# Altium project Napelem_inverter.PrjPcb (part 1 of 2)
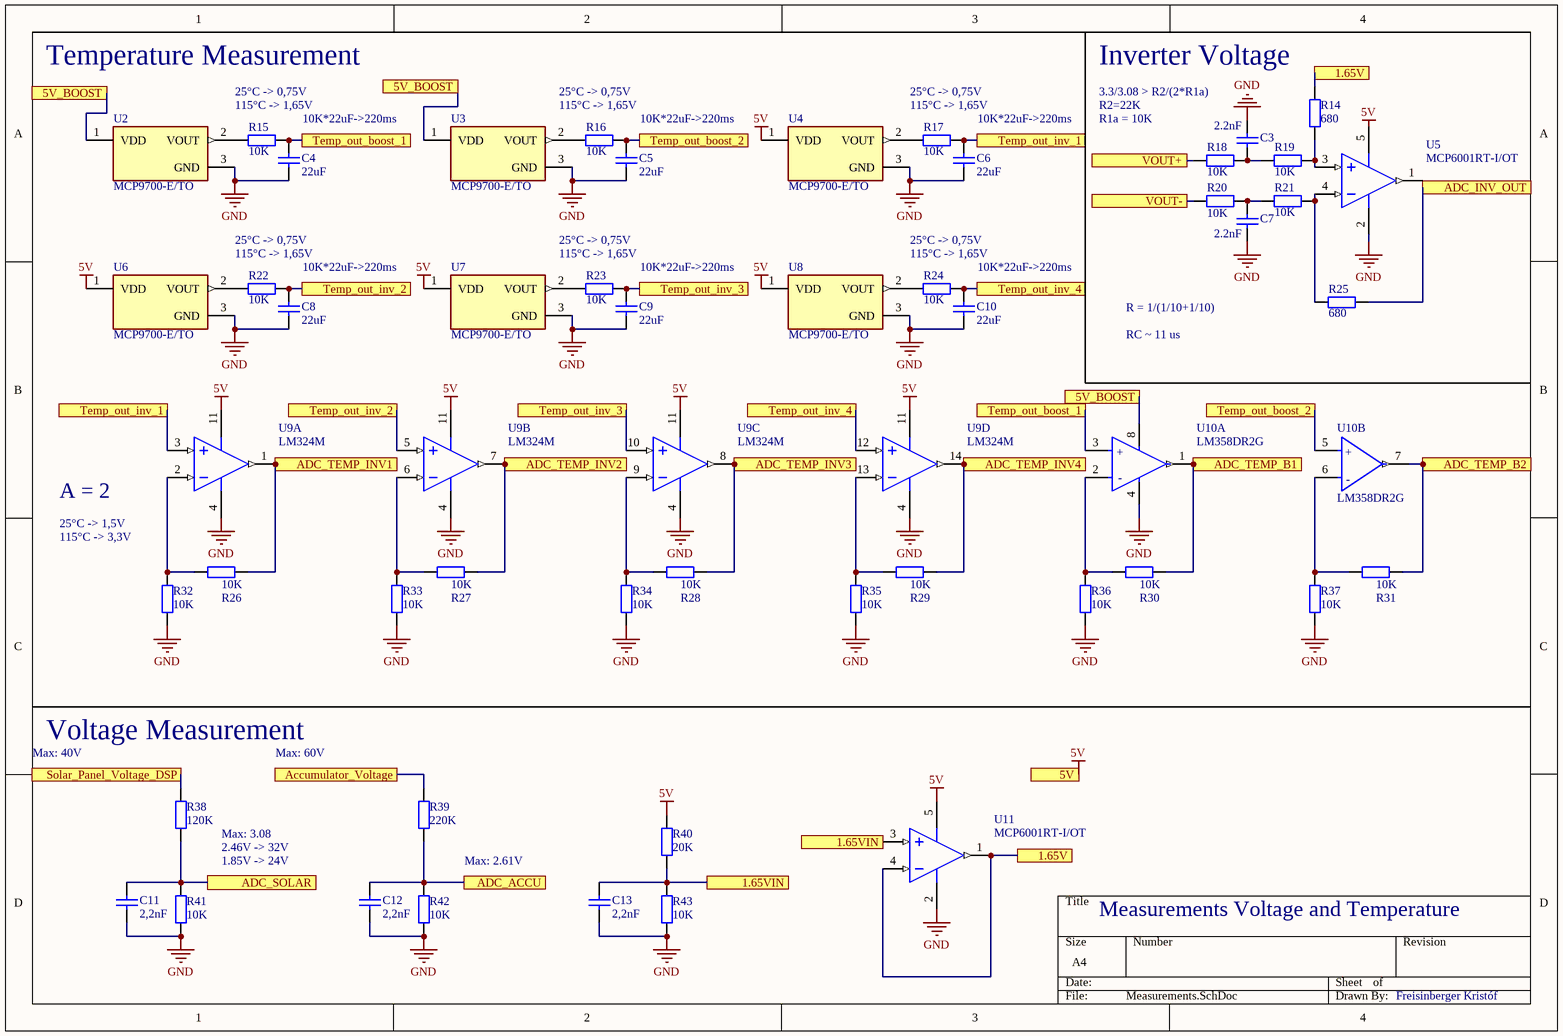
[diagram p0: Measurements.SchDoc]
12 sheets, 313 parts. Net scope: flat (ports and power ports of the same name join across sheets).
Board files: Boost.PcbDoc, Napelemes_inverter.PcbDoc, Boost_Test.PcbDoc, Napelem_inverter_0805.PcbDoc
Sheets:
  Measurements.SchDoc
  PowerSupply.SchDoc
  BoostConverter.SchDoc
  Inverter.SchDoc
  Gate-Driver.SchDoc
  Block_Design.SchDoc
    DSP = DSP.SchDoc
    Connectors = Connectors.SchDoc
    Current Measurement = Hall_sensor.SchDoc
    USB = USB_and_FTDI.SchDoc
  Display.SchDoc
  DSP_Supply.SchDoc

## Sheet Measurements.SchDoc
size A4

### Parts
C3  2.2nF  [FP_0805_CAP_085]
C4  22uF  [FP_0805_CAP_085]
C5  22uF  [FP_0805_CAP_085]
C6  22uF  [FP_0805_CAP_085]
C7  2.2nF  [FP_0805_CAP_085]
C8  22uF  [FP_0805_CAP_085]
C9  22uF  [FP_0805_CAP_085]
C10  22uF  [FP_0805_CAP_085]
C11  2,2nF  [FP_0805_CAP_085]
C12  2,2nF  [FP_0805_CAP_085]
C13  2,2nF  [FP_0805_CAP_085]
R14  680  [FP_0805_RES]
R15  10K  [FP_0805_RES]
R16  10K  [FP_0805_RES]
R17  10K  [FP_0805_RES]
R18  10K  [FP_0805_RES]
R19  10K  [FP_0805_RES]
R20  10K  [FP_0805_RES]
R21  10K  [FP_0805_RES]
R22  10K  [FP_0805_RES]
R23  10K  [FP_0805_RES]
R24  10K  [FP_0805_RES]
R25  680  [FP_0805_RES]
R26  10K  [FP_0805_RES]
R27  10K  [FP_0805_RES]
R28  10K  [FP_0805_RES]
R29  10K  [FP_0805_RES]
R30  10K  [FP_0805_RES]
R31  10K  [FP_0805_RES]
R32  10K  [FP_0805_RES]
R33  10K  [FP_0805_RES]
R34  10K  [FP_0805_RES]
R35  10K  [FP_0805_RES]
R36  10K  [FP_0805_RES]
R37  10K  [FP_0805_RES]
R38  120K  [FP_0805_RES]
R39  220K  [FP_0805_RES]
R40  20K  [FP_0805_RES]
R41  10K  [FP_0805_RES]
R42  10K  [FP_0805_RES]
R43  10K  [FP_0805_RES]
U2  MCP9700-E/TO  [FP-C04-101-MFG]
U3  MCP9700-E/TO  [FP-C04-101-MFG]
U4  MCP9700-E/TO  [FP-C04-101-MFG]
U5  MCP6001RT-I/OT  [SOT-23-OT5_M]
U6  MCP9700-E/TO  [FP-C04-101-MFG]
U7  MCP9700-E/TO  [FP-C04-101-MFG]
U8  MCP9700-E/TO  [FP-C04-101-MFG]
U9  LM324M  [FP_SOIC14]  (parts A,B,C,D of 4)
U10  LM358DR2G  [FP-751-07-IPC_C]  (parts A,B of 2)
U11  MCP6001RT-I/OT  [SOT-23-OT5_M]

### Ports
1.65V, 1.65VIN, 5V, 5V_BOOST, Accumulator_Voltage, ADC_ACCU, ADC_INV_OUT, ADC_SOLAR, ADC_TEMP_B1, ADC_TEMP_B2, ADC_TEMP_INV1, ADC_TEMP_INV2, ADC_TEMP_INV3, ADC_TEMP_INV4, Solar_Panel_Voltage_DSP, Temp_out_boost_1, Temp_out_boost_2, Temp_out_inv_1, Temp_out_inv_2, Temp_out_inv_3, Temp_out_inv_4, VOUT+, VOUT-

### Nets
5V: R40.2 U4.1(VDD) U6.1(VDD) U7.1(VDD) U8.1(VDD) U9.11(GND) U11.5(VSS) ; port 5V
GND: C3.2 C4.1 C5.1 C6.1 C7.1 C8.1 C9.1 C10.1 C11.1 C12.1 C13.1 R32.1 R33.1 R34.1 R35.1 R36.1 R37.1 R41.1 R42.1 R43.1 U2.3(GND) U3.3(GND) U4.3(GND) U5.2(VDD) U6.3(GND) U7.3(GND) U8.3(GND) U9.4(V+) U10.4(VEE/GND) U11.2(VDD)  [project net Accumulator_GND]
NetC3_1: C3.1 R18.2 R19.1
NetC4_2: C4.2 R15.2 U10.3(INPUT_A+) ; port Temp_out_boost_1
NetC5_2: C5.2 R16.2 U10.5(INPUT_B+) ; port Temp_out_boost_2
NetC6_2: C6.2 R17.2 U9.3(IN1+) ; port Temp_out_inv_1
NetC7_2: C7.2 R20.2 R21.1
NetC8_2: C8.2 R22.2 U9.5(IN2+) ; port Temp_out_inv_2
NetC9_2: C9.2 R23.2 U9.10(IN3+) ; port Temp_out_inv_3
NetC10_2: C10.2 R24.2 U9.12(IN4+) ; port Temp_out_inv_4
NetC11_2: C11.2 R38.1 R41.2 ; port ADC_SOLAR
NetC12_2: C12.2 R39.1 R42.2 ; port ADC_ACCU
NetC13_2: C13.2 R40.1 R43.2 U11.3(VIN+) ; port 1.65VIN
NetC14_1: R38.2 ; port Solar_Panel_Voltage_DSP
NetC31_2: R39.2 ; port Accumulator_Voltage
NetC44_1: R20.1 ; port VOUT-
NetC44_2: R18.1 ; port VOUT+
NetJ4_4: R30.1 U10.1(OUTPUT_A) ; port ADC_TEMP_B1
NetJ4_6: R31.1 U10.7(OUTPUT_B) ; port ADC_TEMP_B2
NetJ4_10: U2.1(VDD) U3.1(VDD) U10.8(VCC) ; port 5V_BOOST
NetP2_3: R25.2 ; port ADC_INV_OUT
NetP3_3: R26.1 U9.1(OUT1) ; port ADC_TEMP_INV1
NetP3_4: R27.1 U9.7(OUT2) ; port ADC_TEMP_INV2
NetP3_5: R28.1 U9.8(OUT3) ; port ADC_TEMP_INV3
NetP3_6: R29.1 U9.14(OUT4) ; port ADC_TEMP_INV4
NetR14_1: R14.1 R19.2 U5.3(VIN+)
NetR14_2: R14.2 U11.1(VOUT) U11.4(VIN-) ; port 1.65V
NetR15_1: R15.1 U2.2(VOUT)
NetR16_1: R16.1 U3.2(VOUT)
NetR17_1: R17.1 U4.2(VOUT)
NetR21_2: R21.2 R25.1 U5.4(VIN-)
NetR22_1: R22.1 U6.2(VOUT)
NetR23_1: R23.1 U7.2(VOUT)
NetR24_1: R24.1 U8.2(VOUT)
NetR26_2: R26.2 R32.2 U9.2(IN1-)
NetR27_2: R27.2 R33.2 U9.6(IN2-)
NetR28_2: R28.2 R34.2 U9.9(IN3-)
NetR29_2: R29.2 R35.2 U9.13(IN4-)
NetR30_2: R30.2 R36.2 U10.2(INPUT_A-)
NetR31_2: R31.2 R37.2 U10.6(INPUT_B-)

Not connected (* = marked no-connect by the designer): U5 1(VOUT) 5(VSS)

### Notes on the sheet
- Temperature Measurement
- 115°C -> 1,65V
- 25°C -> 0,75V
- 3.3/3.08 > R2/(2*R1a)
- (near R14) Inverter Voltage
- R2=22K
- 10K*22uF->220ms
- R1a = 10K
- R = 1/(1/10+1/10)
- RC ~ 11 us
- A = 2
- 115°C -> 3,3V
- 25°C -> 1,5V
- Max: 40V
- Voltage Measurement
- Max: 60V
- 2.46V -> 32V
- (near R38) Max: 3.08
- 1.85V -> 24V
- Max: 2.61V
- Measurements Voltage and Temperature
- Freisinberger Kristóf
- Labels drawn without touching a wire or pin: 5V
- (in symbol CMP-1310-00291-2, part A) +; -
- (in symbol CMP-1310-00291-2, part B) +; -

### Library data of the parts
C3-C13 = CAP: Capacitor
  C3 C7: Value: 2.2nF
  C4-C6 C8-C10: Value: 22uF
  C11-C13: Value: 2,2nF
R14-R43 = RES: Resistor
  R14 R25: Value: 680
  R15-R24 R26-R37 R41-R43: Value: 10K
  R38: Value: 120K
  R39: Value: 220K
  R40: Value: 20K
U2-U4 U6-U8 = CMP-0192-00001-2: SENSOR ANALOG -40C-125C TO92-3; Manufacturer: Microchip; Output Current: 100uA; Sensor Output: Analog Voltage; Output Voltage: 500mV; Max Supply Voltage: 5.5V; Import Ts: 1521170835; Min Supply Voltage: 2.3V; Operating Supply Current: 6uA; Max Junction Temp: +150°C; RoHS: TRUE; Height: 5.334mm; Manufacturer Part Number: MCP9700-E/TO; Ipc Land Pattern Name: TO-92; Digikey Description: SENSOR ANALOG -40C-125C TO92-3; Device Class L1: Sensors; Footprint Url: http://ww1.microchip.com/downloads/en/DeviceDoc/3L_TO-92%20Plastic%20Transistor%20Outline_TO_C04-00101c.pdf; Automotive: No; Mouser Description: Board Mount Temperature Sensors Lin Active Therm; ComponentLink2Description: Datasheet; Device Class L2: Temperature and Humidity Sensors; Ambient Temperature Range Low: -40°C; Package: C04-101; Device Class L3: unset; Temperature: -40°C to +125°C; Ambient Temperature Range High: +125°C; Temperature Range High: +125°C; Lead Free: Yes; Category: IC; ComponentLink2URL: http://ww1.microchip.com/downloads/en/DeviceDoc/20001942G.pdf; Temperature Range Low: -40°C; Octopart: https://octopart.com/mcp9700-e%2Fto-microchip-668812
U5 U11 = CMP-0187-00469-2: 1 MHz, Low-Power Operational Amplifier, 5-Pin SOT-23, Industrial Temperature, Tape and Reel; ComponentLink1URL: http://www.microchip.com/; DatasheetVersion: revJ, Nov-2009; PackageVersion: revBB, Aug-2009; RevisionNote: URLs added.; ComponentLink1Description: Manufacturer URL; PackageReference: SOT-23-OT5; ComponentLink3Description: Package Specification; ComponentLink2Description: Datasheet; ComponentLink2URL: http://ww1.microchip.com/downloads/en/DeviceDoc/21733j.pdf; ComponentLink3URL: http://www.microchip.com/stellent/groups/techpub_sg/documents/packagingspec/en012702.pdf; PackageDescription: 5-Lead Plastic Small Outline Transistor (OT) [SOT-23]; Code_IPC: SOT23-5
U9 = LM324M: Low Power Quad Operational Amplifier, 14-pin Narrow SOIC; Code_JEDEC: MS-012AB; Code_IPC: SOIC127P600-14; ComponentLink1Description: LM324 Datasheet; ComponentLink1URL: http://www.national.com/ds/LM/LM324.pdf; ComponentLink2Description: LM324 Web Page; ComponentLink2URL: http://www.national.com/pf/LM/LM324.html; ComponentLink3Description: M14A Package Page; ComponentLink3URL: http://www.national.com/packaging/folders/m14a.html
U10 = CMP-1310-00291-2: IC OPAMP GP 2 CIRCUIT 8SOIC; Gain Bandwidth Product: 1MHz; Number of Circuits: 2; Min Supply Voltage: 3V; Slew Rate: 0.6V/µs; Max Dual Supply Voltage: 16V; Common Mode Rejection Ratio: 65dB; Input Bias Current: 250nA; Min Dual Supply Voltage: 1.5V; Dual Supply Voltage: 9V; Operating Supply Current: 1.5mA; Output Current: 40mA; Input Offset Voltage (Vos): 7mV; Nominal Supply Current: 1.2mA; Voltage Gain: 100dB; Max Supply Voltage: 32V; Width: 4mm; Number of Pins: 8; Min Operating Temperature: 0°C; REACH SVHC: No SVHC; Contact Plating: Tin; Lead Free: Lead Free; Halogen Free: Halogen Free; Power Supply Rejection Ratio (PSRR): 65dB; Operating Supply Voltage: 16V; Package Quantity: 2500; Max Operating Temperature: 70°C; Case/Package: SOIC; Height: 1.5mm; Packaging: Tape and Reel; Radiation Hardening: No; Number of Channels: 2; Bandwidth: 1MHz; Length: 5mm; Number of Elements: 2; Number of Amplifiers: 2; Output Current per Channel: 40mA

## Sheet PowerSupply.SchDoc
size A4
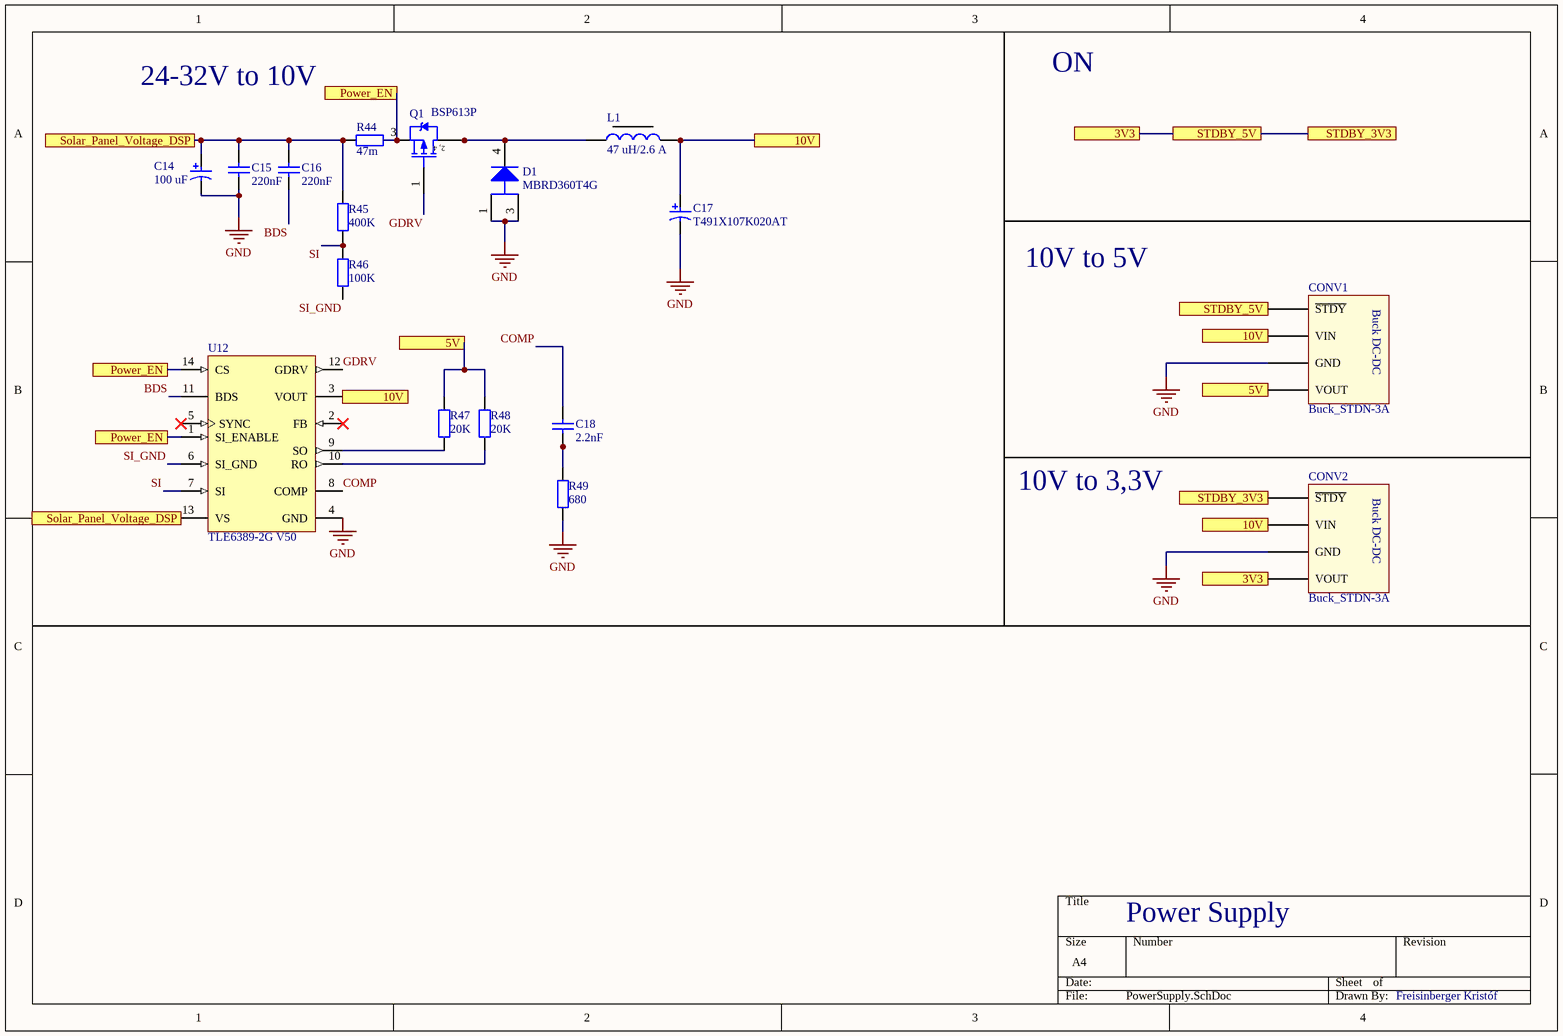
[diagram p1: PowerSupply.SchDoc]

### Parts
C14  100 uF  [NIC-UVR-10x12.5-2_V]
C15  220nF  [FP_0805_CAP_085]
C16  220nF  [FP_0805_CAP_085]
C17  T491X107K020AT  [KEMT-7343-43_L]
C18  2.2nF  [FP_0805_CAP_085]
CONV1  Buck_STDN-3A  [Buck_STDN-3A24-ADJ]
CONV2  Buck_STDN-3A  [Buck_STDN-3A24-ADJ]
D1  MBRD360T4G  [ONSC-DPAK-3-369C-01_V]
L1  47 uH/2.6 A  [Tekercs_B82479-A1473-M - duplicate]
Q1  BSP613P  [INF-PG-SOT223_SC-73_M]
R44  47m  [FP_0805_RES]
R45  400K  [FP_0805_RES]
R46  100K  [FP_0805_RES]
R47  20K  [FP_0805_RES]
R48  20K  [FP_0805_RES]
R49  680  [FP_0805_RES]
U12  TLE6389-2G V50  [INF-PG-DSO-14-1_M]

### Ports
3V3, 5V, 10V, Power_EN, Solar_Panel_Voltage_DSP, STDBY_3V3, STDBY_5V

### Nets
3V3: CONV1.1(~{STDY}) CONV2.1(~{STDY}) CONV2.4(VOUT) ; port STDBY_5V, port STDBY_3V3, port 3V3
5V: CONV1.4(VOUT) R47.2 R48.2 ; port 5V
10V: C17.1 CONV1.2(VIN) CONV2.2(VIN) L1.2(Out) U12.3(VOUT) ; port 10V
GND: C14.2 C15.1 C17.2 CONV1.3(GND) CONV2.3(GND) D1.1(A) D1.3(A) R49.1 U12.4(GND)  [project net Accumulator_GND]
BDS: C16.1 U12.11(BDS)
COMP: C18.2 U12.8(COMP)
GDRV: Q1.1(GATE) U12.12(GDRV)
SI: R45.1 R46.2 U12.7(SI)
SI_GND: R46.1 U12.6(SI_GND)
NetC14_1: C14.1 C15.2 C16.2 R44.2 R45.2 U12.13(VS) ; port Solar_Panel_Voltage_DSP
NetC18_1: C18.1 R49.2
NetD1_4: D1.4(K) L1.1(In) Q1.2(DRAIN) Q1.4(DRAIN)
NetQ1_3: Q1.3(SOURCE) R44.1 U12.1(SI_ENABLE) U12.14(CS) ; port Power_EN
NetR47_1: R47.1 U12.9(SO)
NetR48_1: R48.1 U12.10(RO)

Not connected (* = marked no-connect by the designer): U12 2(FB)* 5(SYNC)*

### Notes on the sheet
- 24-32V to 10V
- ON
- 10V to 5V
- 10V to 3,3V
- Power Supply
- Freisinberger Kristóf
- (in symbol Buck_STDN-3A) Buck DC-DC
- (in symbol CMP-1099-00021-1) 2, 4

### Library data of the parts
C14 = CMP-1217-00001-1: Aluminum Electrolytic Capacitor, 63 V, -40 to 85 degC, 2-Pin CAP, RoHS; Manufacturer: Nichicon; PartNumber: UVR1J101MPD1TD; Capacitance Tolerance: +/-20%; Rated Voltage: 63 V; Packing: Bulk; Rated Ripple@85 degC 120 Hz: 300 mA; ComponentLink3URL: https://il.farnell.com/teapo/ksy107m063s1g5h1ck/cap-100-f-63v-20/dp/2901348?st=100%20uf%20electrolyte%20capacitor; ComponentLink2Description: Datasheet; Operating Temperature: -40 to 85 degC; PackageDescription: 2-Pin Through Hole Package, Dia 10 mm, Body Length 12.5 mm, Pitch 5 mm; Mounting Technology: Through Hole; ComponentLink3Description: Package Specification; RoHS: TRUE; DatasheetVersion: Sep-13; ComponentLink1Description: Manufacturer URL; ComponentLink2URL: https://il.farnell.com/teapo/ksy107m063s1g5h1ck/cap-100-f-63v-20/dp/2901348?st=100%20uf%20electrolyte%20capacitor; Rated Capacitance: 100 uF; ComponentLink1URL: http://www.nichicon.co.jp/
C15 C16 C18 = CAP: Capacitor
  C15 C16: Value: 220nF
  C18: Value: 2.2nF
C17 = CMP-2000-07204-1: Tantalum Surface Mount Capacitor, 100 uF, 25 V, -55 to 125 degC, 2-Pin Molded, RoHS, Tape and Reel; Manufacturer: Kemet; Manufacturer Size Code: X; ESR (Equivalent Series Resistance): 300mOhm; Tolerance: ±10%; Capacitance: 100µF; Voltage - Rated: 25V; Product Training Modules: CapacitorBasics-TypicalUsesforCapacitors; Other Names: 399-8410-6; Lifetime @ Temp.: 2000Hrs@85°C; Online Catalog: T491Series; EDA / CAD Models: DownloadfromAcceleratedDesigns; Mounting Type: SurfaceMount; Series: T491; Packaging: Digi-Reel®; Category: Capacitors; Family: TantalumCapacitors; Manufacturer URL: http://www.kemet.com/; Datasheet URL: https://ciiva.com/datasheet-click-3798150?src=ciiva&sig=eb1f20b4; Mounting Technology: SurfaceMount; Lead Spacing: -; Datasheet Version: 12/2015; Standard Package: 1; Type: Molded; Features: GeneralPurpose; Package Description: 2-Pin Molded Capacitor, Body 7.3 x 4.3 mm; Size / Dimension: 0.287"Lx0.169"W(7.30mmx4.30mm); Package Reference: Molded; Height - Seated (Max): 0.169"(4.30mm); Package / Case: 2917(7343Metric); Operating Temperature: -55°C~125°C
D1 = CMP-1055-00192-1: SWITCHMODE(TM) Power Rectifier, 3-Pin DPAK, Pb-Free, Tape and Reel; Manufacturer: On Semiconductor; Configuration: Single; IFSM Max (A): 75; Mounting Technology: Surface Mount; ComponentLink2Description: Datasheet; ComponentLink3URL: http://www.onsemi.cn/pub_link/Collateral/369C.PDF; DatasheetVersion: Rev. 8; ComponentLink2URL: http://www.onsemi.com/pub_link/Collateral/MBRD320-D.PDF; PackageDescription: 3-Pin Flange Mount, Body 6.54 x 6.095 mm, Pitch 2.29 mm; ComponentLink1URL: http://www.onsemi.com/; Packing: Tape and Reel; RoHS: TRUE; ComponentLink1Description: Manufacturer URL; ComponentLink3Description: Package Specification; PackageVersion: Rev. E, 02/2014; PackageReference: DPAK-3-369C-01; PartNumber: MBRD360T4G
L1 = Inductor_B82479A1473M000: Inductor Power Wirewound 47uH 20% 100KHz Ferrite 2.6A 87mOhm DCR Automotive T/R; Manufacturer: TDK EPCOS; Saturation Current: 4.5A; Shielding: Unshielded; DC Resistance (DCR): 87mR; Inductor Type: POWER INDUCTOR; Supplier 1: Farnell; Manufacturer Part Number: B82479A1473M000; RoHS: Yes; Category: Fixed Inductors; Stock 1: 25; Mount: Surface Mount; Case/Package: SMD/SMT; Number of Pins: 2; Core Material: Ferrite; Weight: 0.105822oz; Min Operating Temperature: -55°C; Max Operating Temperature: 150°C; Package Quantity: 250; Current Rating: 2.6A; Tolerance: 20%; Packaging: Tape and Reel; Inductance Tolerance: 20%; Self Resonant Frequency: 100kHz; Inductance: 47uH; Test Frequency: 100kHz; Max DC Current: 2.6A; Termination: SMD/SMT; RMS Current (Irms): 2.6A; DC Current: 2.6A; Series: B82479A1; Length: 18.54mm; Width: 0.6inch; Height: 7.11mm; Depth: 15.24mm; REACH SVHC: No SVHC; Military Standard: Not; Lead Free: Lead Free; RoHS Compliant: Yes; ComponentLink1URL: https://datasheet.ciiva.com/6692/b82479a1-6692885.pdf?src-supplier=Digi-Key; ComponentLink1Description: https://datasheet.ciiva.com/6692/b82479a1-6692885.pdf?src-supplier=Digi-Key; ComponentLink2URL: https://datasheet.ciiva.com/22683/1899175-22683671.pdf?src-supplier=Element14; ComponentLink2Description: https://datasheet.ciiva.com/22683/1899175-22683671.pdf?src-supplier=Element14; ComponentLink3URL: https://datasheet.ciiva.com/22683/1899175-22683672.pdf?src-supplier=Element14; ComponentLink3Description: https://datasheet.ciiva.com/22683/1899175-22683672.pdf?src-supplier=Element14; ComponentLink4URL: https://datasheet.ciiva.com/28652/b82479a1-28652056.pdf?src-supplier=Element14; ComponentLink4Description: https://datasheet.ciiva.com/28652/b82479a1-28652056.pdf?src-supplier=Element14
Q1 = CMP-1099-00021-1: P-Channel SIPMOS Small-Signal-Transistor, -60 V VDS, -2.9 A ID, -55 to 150 degC, PG-SOT223 (SC-73), Reel, Green; Manufacturer: Infineon; VDS (max): -60Â V; ID (max): -2.9Â A; QG: -22Â nC; VGS(th) (max): -4Â V; Rth: 100Â K/W; Polarity: P; VGS(th) (min): -2.1Â V; IDpuls (max): -11.6Â A; Mode: Enhancement; RDS (on) (max): 130Â mOhm; Pto t (max): 1.8Â W; Green: TRUE; ComponentLink2Description: Datasheet; DatasheetVersion: Rev. 2.7; ComponentLink3URL: http://www.infineon.com/dgdl/SOT223-Package_Overview.pdf?folderId=db3a30431936bc4b0119530470b03c3d&fileId=db3a30431936bc4b0119531d40b93c5c; Packing: Reel; Halogen-free: TRUE; PackageReference: PG-SOT223 (SC-73); PackageVersion: Apr-08; PackageDescription: 4-Pin Small Outline Transistor Package, 6.5 x 3.5 mm Body, 2.3 mm Pitch; ComponentLink2URL: http://www.infineon.com/dgdl/BSP613P_Rev2.7.pdf?folderId=db3a304314dca38901154a72e3951a65&fileId=db3a30433b47825b013b60ac86a96dc0; ComponentLink1Description: Manufacturer URL; ComponentLink3Description: Package Specification; Mounting Technology: Surface Mount; Technology: SIPMOS; PartNumber: BSP613P; ComponentLink1URL: http://www.infineon.com/
R44-R49 = RES: Resistor
  R44: Value: 47m
  R45: Value: 400K
  R46: Value: 100K
  R47 R48: Value: 20K
  R49: Value: 680
U12 = CMP-1093-00004-1: Step-Down DC/DC Controller, -40 to 150 degC, PG-DSO-14-1, Reel, Green; Manufacturer: Infineon; Output: Buck Converter; Iq (typ): 130 uA; VQ (max): 5V; Tolerance: 3%; Green: TRUE; IQ (max): 2,300 mA; ComponentLink1URL: http://www.infineon.com/; ComponentLink3URL: http://www.infineon.com/dgdl/DCDC-Controller-IFX80471-Data-Sheet-V10-Infineon.pdf?folderId=db3a304314dca3890115039cf70d0bf0&fileId=db3a30432e398416012e487ec6e42599; PartNumber: TLE6389-2G V50; PackageVersion: Apr-11; ComponentLink3Description: Package Specification; DatasheetVersion: Rev. 2.1; PackageReference: PG-DSO-14-1; PackageDescription: 14-Pin Plastic (Green) Dual Small Outline Package, 8.65 x 3.9 mm Body, 1.27 mm Pitch; ComponentLink2URL: http://www.infineon.com/dgdl/TLE6389-2-3_DS_21.pdf?folderId=db3a304412b407950112b408e8c90004&fileId=db3a304412b407950112b43641bf65a6&location=en.Products.Power_Management_ICs.DC_DC.DC_DC-Converter__Automotive_.DATASHEET.TLE6389-2-3_DS_21.pdf; Halogen-free: TRUE; ComponentLink1Description: Manufacturer URL; Packing: Reel; Mounting Technology: Surface Mount; ComponentLink2Description: Datasheet

## Sheet BoostConverter.SchDoc
size A4
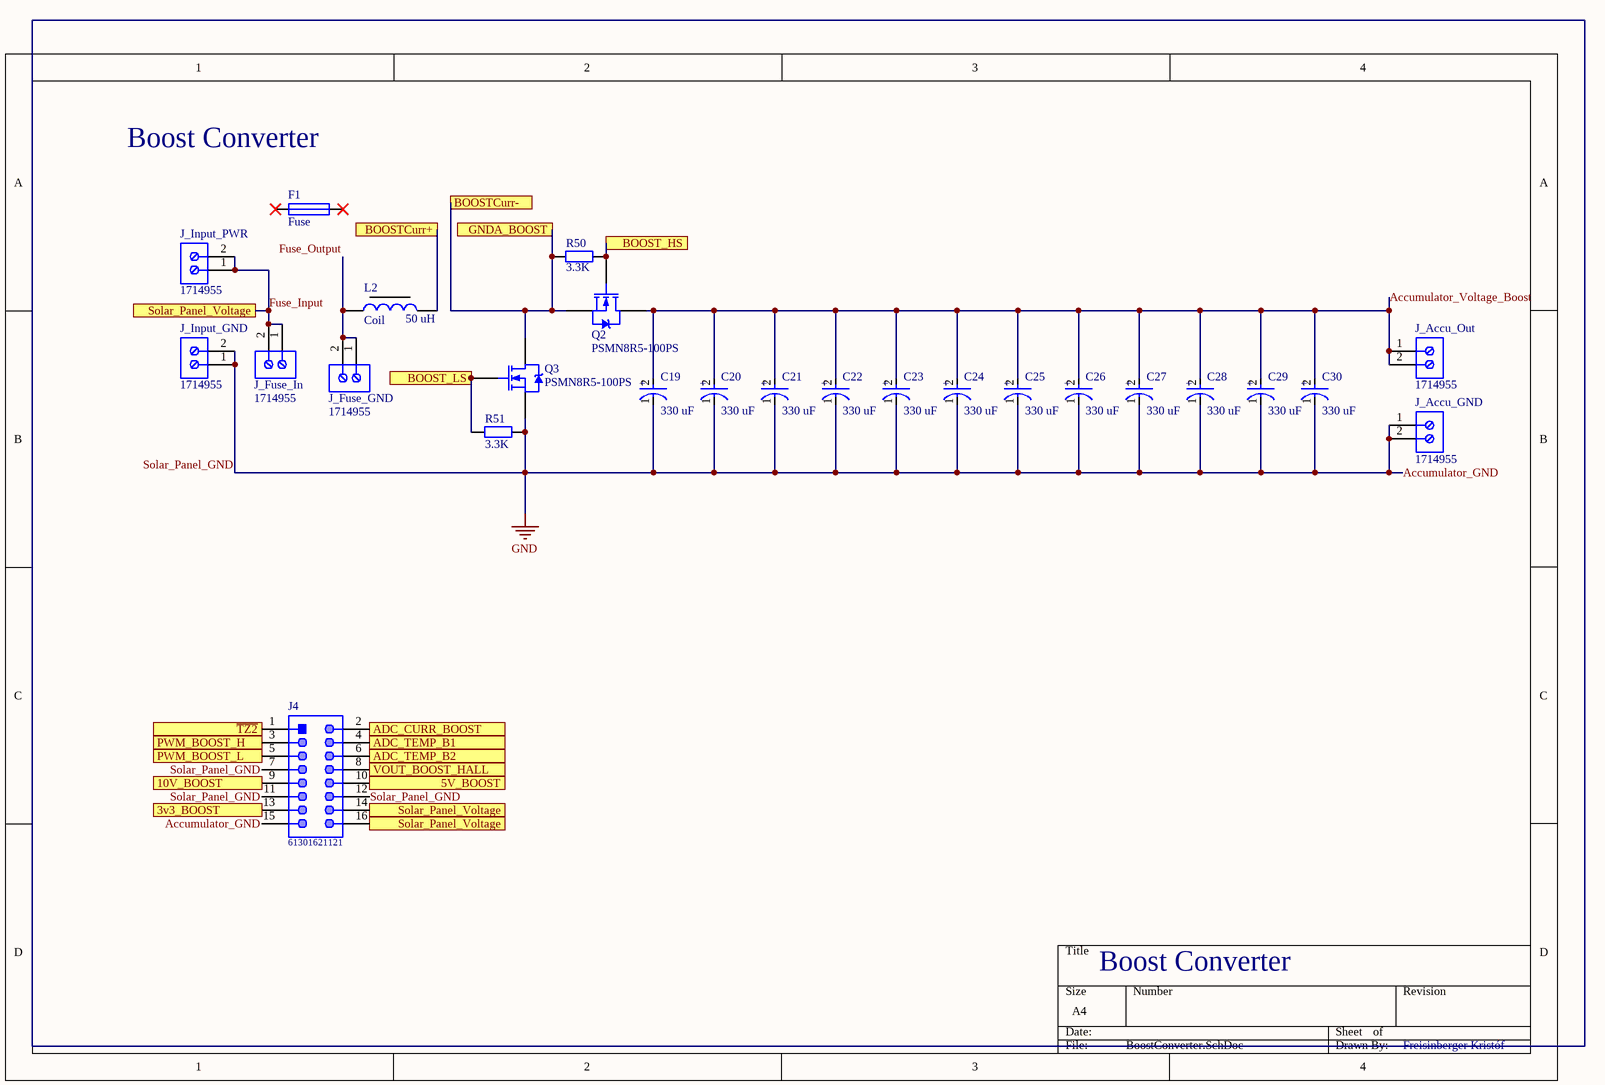
[diagram p2: BoostConverter.SchDoc]

### Parts
C19  330 uF  [FP-LXW18X25-MFG]
C20  330 uF  [FP-LXW18X25-MFG]
C21  330 uF  [FP-LXW18X25-MFG]
C22  330 uF  [FP-LXW18X25-MFG]
C23  330 uF  [FP-LXW18X25-MFG]
C24  330 uF  [FP-LXW18X25-MFG]
C25  330 uF  [FP-LXW18X25-MFG]
C26  330 uF  [FP-LXW18X25-MFG]
C27  330 uF  [FP-LXW18X25-MFG]
C28  330 uF  [FP-LXW18X25-MFG]
C29  330 uF  [FP-LXW18X25-MFG]
C30  330 uF  [FP-LXW18X25-MFG]
F1  Fuse
J4  61301621121  [61301621121]
J_Accu_GND  1714955  [Terminal-PHOE-1714955_V]
J_Accu_Out  1714955  [Terminal-PHOE-1714955_V]
J_Fuse_GND  1714955  [Terminal-PHOE-1714955_V]
J_Fuse_In  1714955  [Terminal-PHOE-1714955_V]
J_Input_GND  1714955  [Terminal-PHOE-1714955_V]
J_Input_PWR  1714955  [Terminal-PHOE-1714955_V]
L2  Coil  value 50 uH  [Tekercs_E65_FERRITE]
Q2  PSMN8R5-100PS  [FP-TO-220AB-MFG]
Q3  PSMN8R5-100PS  [FP-TO-220AB-MFG]
R50  3.3K  [FP_0805_RES]
R51  3.3K  [FP_0805_RES]

### Ports
3v3_BOOST, 5V_BOOST, 10V_BOOST, ADC_CURR_BOOST, ADC_TEMP_B1, ADC_TEMP_B2, BOOST_HS, BOOST_LS, BOOSTCurr+, BOOSTCurr-, GNDA_BOOST, PWM_BOOST_H, PWM_BOOST_L, Solar_Panel_Voltage, VOUT_BOOST_HALL, ~{TZ2}

### Nets
Accumulator_GND: C19.1(C) C20.1(C) C21.1(C) C22.1(C) C23.1(C) C24.1(C) C25.1(C) C26.1(C) C27.1(C) C28.1(C) C29.1(C) C30.1(C) J4.7 J4.11 J4.12 J4.15 J_Accu_GND.1 J_Accu_GND.2 J_Input_GND.1 J_Input_GND.2 Q3.3(S) R51.2  [also labelled GND, Solar_Panel_GND]
Accumulator_Voltage_Boost: C19.2(A) C20.2(A) C21.2(A) C22.2(A) C23.2(A) C24.2(A) C25.2(A) C26.2(A) C27.2(A) C28.2(A) C29.2(A) C30.2(A) J_Accu_Out.1 J_Accu_Out.2 Q2.2(D)
Fuse_Input: J4.14 J4.16 J_Fuse_In.1 J_Fuse_In.2 J_Input_PWR.1 J_Input_PWR.2 ; port Solar_Panel_Voltage
Fuse_Output: J_Fuse_GND.1 J_Fuse_GND.2 L2.1(In)
NetC58_2: J4.9 ; port 10V_BOOST
NetC60_1: Q2.3(S) Q3.2(D) R50.1 ; port BOOSTCurr-, port GNDA_BOOST
NetC69_1: J4.2 ; port ADC_CURR_BOOST
NetC102_2: J4.13 ; port 3v3_BOOST
NetJ4_1: J4.1 ; port ~{TZ2}
NetJ4_3: J4.3 ; port PWM_BOOST_H
NetJ4_4: J4.4 ; port ADC_TEMP_B1
NetJ4_5: J4.5 ; port PWM_BOOST_L
NetJ4_6: J4.6 ; port ADC_TEMP_B2
NetJ4_8: J4.8 ; port VOUT_BOOST_HALL
NetJ4_10: J4.10 ; port 5V_BOOST
NetL2_2: L2.2(Out) ; port BOOSTCurr+
NetQ2_1: Q2.1(G) R50.2 ; port BOOST_HS
NetQ3_1: Q3.1(G) R51.1 ; port BOOST_LS

Not connected (* = marked no-connect by the designer): F1 1* 2*

### Notes on the sheet
- Boost Converter
- Freisinberger Kristóf
- (in symbol CMP-35376-000008-1) +

### Library data of the parts
C19-C30 = CMP-35376-000008-1: CAP ALUM 47UF 20% 500V THRUHOLE / 500LXW47MEFR18X25
F1 = Fuse_Fork_Lift_157.5700.5501: LITTELFUSE   157.5700.5501   Automotive Fuse, Fork Lift Truck, 157.5700 Series, 50 A, Fast Acting, 48 V; Body Material: ZINC ALLOY; Current Rating: 50A; Voltage Rating (DC): 48V; Type: Electrical; Voltage Rating: 80V; Supplier 1: Digi-Key; Manufacturer: Littelfuse; Manufacturer Part Number: 157.5700.5501; RoHS: Yes; Category: Fuses; Stock 1: 20; Pricing 1: 1=1,98000, 5=1,89000, 10=1,79600, 50=1,44900, 100=1,22850, 250=1,19700, 500=1,00800, 1000=0,89775, 5000=0,83790 (USD); Mount: Bolt; Min Operating Temperature: -40°C; Max Operating Temperature: 125°C; Fuse Current: 50A; Packaging: Bulk; Series: -; Termination: Lug; Length: 82mm; Width: 20mm; Height: 0.03inch; REACH SVHC: Unknown; RoHS Compliant: Yes; ComponentLink1URL: https://datasheet.ciiva.com/1729/68907-1729142.pdf?src-supplier=Newark; ComponentLink1Description: https://datasheet.ciiva.com/1729/68907-1729142.pdf?src-supplier=Newark; ComponentLink2URL: https://datasheet.ciiva.com/1547/68907-1547992.pdf?src-supplier=Element14; ComponentLink2Description: https://datasheet.ciiva.com/1547/68907-1547992.pdf?src-supplier=Element14
J4 = CMP-1502-01097-1: THT Vertical Pin Header WR-PHD, Pitch 2.54 mm, Dual Row, 16 pins; Manufacturer: Wurth Elektronik; Gender: Male; Rated Current: 3A; Pitch: 2.54mm; Withstanding Voltage: 500VAC; Contact Resistance: 20mOhm; Working Voltage: 250VAC; Pin Number: 16; Mounting Technology: THT; Orientation: Vertical; Manufacturer URL: http://www.we-online.de; Row Number: Dual; Part Number: 61301621121; Datasheet URL: https://katalog.we-online.de/em/datasheet/6130xx21121.pdf; Packaging: Bag; Operating Temperature: -40to105degC; Publisher: WurthElektronik; Package Reference: 61301621121
J_Accu_GND J_Accu_Out J_Fuse_GND J_Fuse_In J_Input_GND J_Input_PWR = Terminal-CMP-2000-05797-1: PC Terminal Block, Pitch 6.35 mm, 1 x 2 Position, Height 21.5 mm, Tail Lenght 5.1 mm, RoHS, Bulk; Manufacturer: Phoenix Contact; Package Description: PC Terminal Block, Pitch 6.35 mm, 1 x 2 Position, Height 21.5 mm, Tail Lenght 5.1 mm; Datasheet URL: http://media.digikey.com/pdf/Data%20Sheets/Phoenix%20Contact%20PDFs/1714955.pdf; Package Reference: 1714955; Manufacturer URL: http://www.phoenixcontact.com/; Datasheet Version: 02/2010; Mounting Technology: ThroughHole
L2 = Coil: 50 uH; Category: Inductor
Q2 Q3 = NMOS-2: N-channel 100 V 8.5 mΩ standard level MOSFET in TO220; Note: Pin 2 is electrically connected to pin 4.; Published: 8-Jun-2000; LatestRevisionDate: 17-Jul-2002; LatestRevisionNote: Re-released for DXP Platform.; DatasheetVersion: PD-9.814; PackageVersion: Feb-1997; PackageReference: TO-220AB; Publisher: Altium Limited; PackageDescription: TO, Thru-Hole, Vertical, Heatsink Mounted; 3 In-Line Leads; Pitch 2.54 mm; ComponentLink1Description: Manufacturer Link; ComponentLink1URL: http://www.irf.com/
R50 R51 = RES: Resistor; Value: 3.3K

## Sheet Inverter.SchDoc
size A4
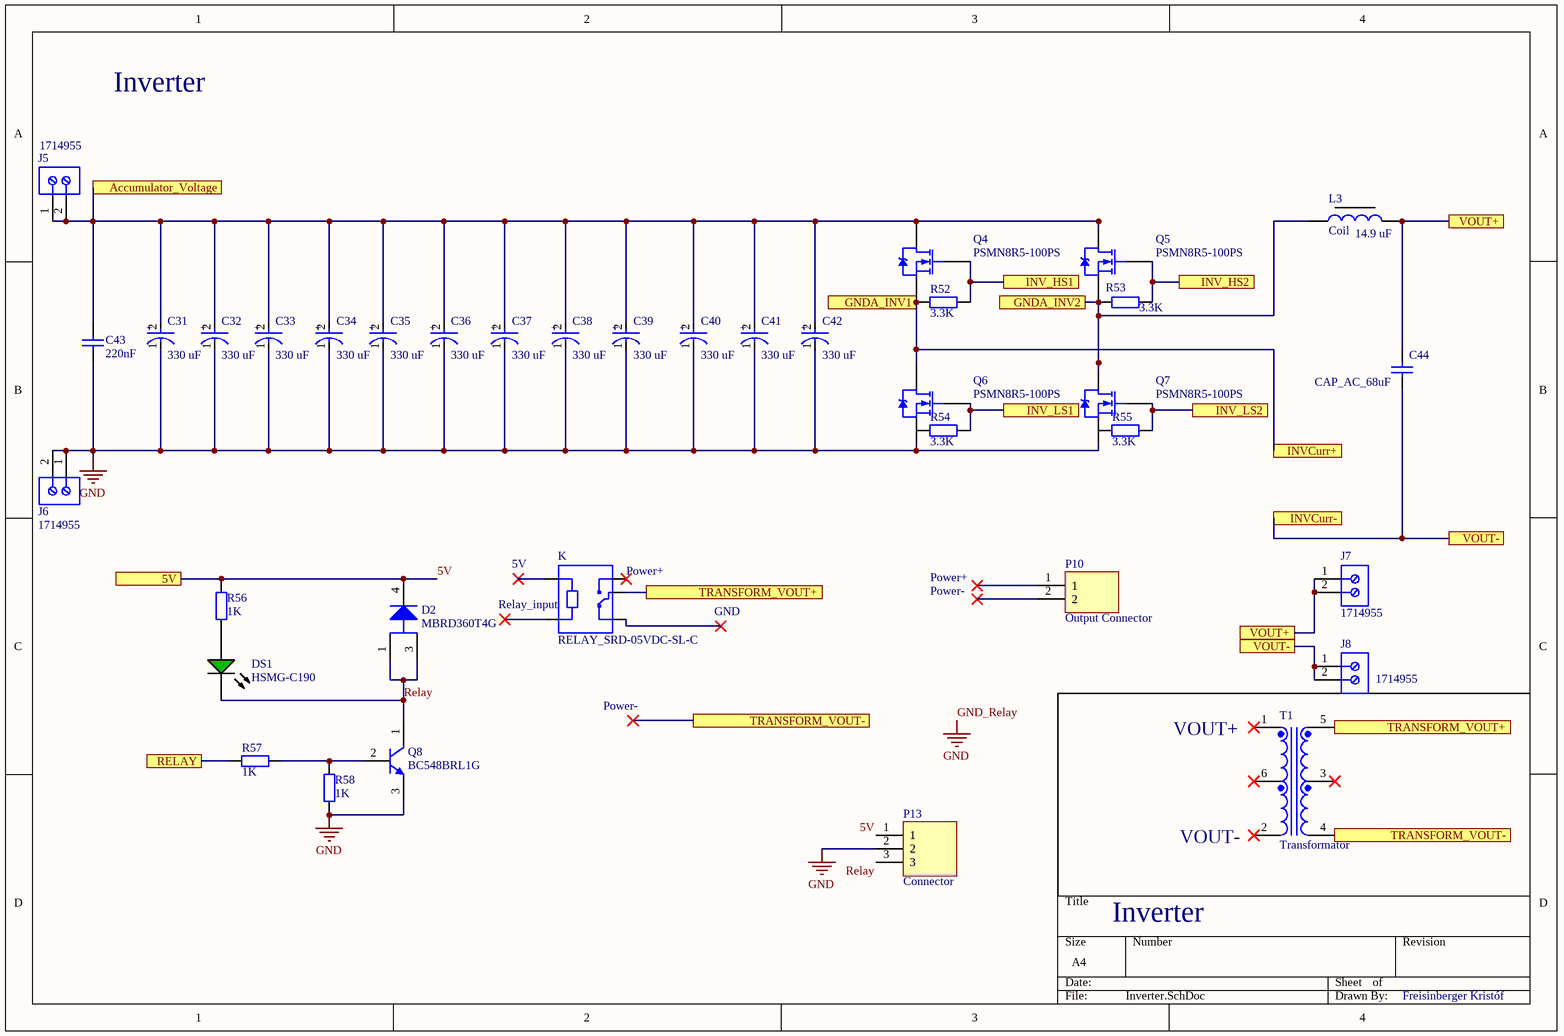
[diagram p3: Inverter.SchDoc]

### Parts
C31  330 uF  [FP-LXW18X25-MFG]
C32  330 uF  [FP-LXW18X25-MFG]
C33  330 uF  [FP-LXW18X25-MFG]
C34  330 uF  [FP-LXW18X25-MFG]
C35  330 uF  [FP-LXW18X25-MFG]
C36  330 uF  [FP-LXW18X25-MFG]
C37  330 uF  [FP-LXW18X25-MFG]
C38  330 uF  [FP-LXW18X25-MFG]
C39  330 uF  [FP-LXW18X25-MFG]
C40  330 uF  [FP-LXW18X25-MFG]
C41  330 uF  [FP-LXW18X25-MFG]
C42  330 uF  [FP-LXW18X25-MFG]
C43  220nF  [FP_0805_CAP_085]
C44  CAP_AC_68uF  [Capacitor_AC_68_uF]
D2  MBRD360T4G  [ONSC-DPAK-3-369C-01_V]
DS1  HSMG-C190  [AVAG-HSMX-C190_V]
J5  1714955  [Terminal-PHOE-1714955_V]
J6  1714955  [Terminal-PHOE-1714955_V]
J7  1714955  [Terminal-PHOE-1714955_V]
J8  1714955  [Terminal-PHOE-1714955_V]
K  RELAY_SRD-05VDC-SL-C  [FP_CONN3_2MM_90]
L3  Coil  value 14.9 uF  [Tekercs_E65_FERRITE]
P10  Output Connector  [FP_CONN2_TAP_254MM]
P13  Connector  [FP_CONN3_TAP_254MM]
Q4  PSMN8R5-100PS  [FP-TO-220AB-MFG]
Q5  PSMN8R5-100PS  [FP-TO-220AB-MFG]
Q6  PSMN8R5-100PS  [FP-TO-220AB-MFG]
Q7  PSMN8R5-100PS  [FP-TO-220AB-MFG]
Q8  BC548BRL1G  [ONSC-TO-92-3-29-11_AM_BL]
R52  3.3K  [FP_0603_RES]
R53  3.3K  [FP_0603_RES]
R54  3.3K  [FP_0603_RES]
R55  3.3K  [FP_0603_RES]
R56  1K  [FP_0603_RES]
R57  1K  [FP_0603_RES]
R58  1K  [FP_0603_RES]
T1  Transformator  [TDK-ALT3232_V]

### Ports
5V, Accumulator_Voltage, GNDA_INV1, GNDA_INV2, INV_HS1, INV_HS2, INV_LS1, INV_LS2, INVCurr+, INVCurr-, RELAY, TRANSFORM_VOUT+, TRANSFORM_VOUT-, VOUT+, VOUT-

### Nets
5V: D2.4(K) P13.1 R56.2 ; port 5V
GND: C31.1(C) C32.1(C) C33.1(C) C34.1(C) C35.1(C) C36.1(C) C37.1(C) C38.1(C) C39.1(C) C40.1(C) C41.1(C) C42.1(C) C43.1 J6.1 J6.2 P13.2 Q6.3(S) Q7.3(S) Q8.3(E) R58.1  [also labelled GND_Relay]  [project net Accumulator_GND]
Relay: D2.1(A) D2.3(A) DS1.2(K) P13.3 Q8.1(C)
NetC31_2: C31.2(A) C32.2(A) C33.2(A) C34.2(A) C35.2(A) C36.2(A) C37.2(A) C38.2(A) C39.2(A) C40.2(A) C41.2(A) C42.2(A) C43.2 J5.1 J5.2 Q4.2(D) Q5.2(D) ; port Accumulator_Voltage
NetC44_1: C44.1 J8.1 J8.2 ; port VOUT-, port INVCurr-
NetC44_2: C44.2 J7.1 J7.2 L3.2(Out) ; port VOUT+
NetC52_1: Q4.3(S) Q6.2(D) R52.1 ; port INVCurr+, port GNDA_INV1
NetC56_1: L3.1(In) Q5.3(S) Q7.2(D) R53.1 ; port GNDA_INV2
NetDS1_1: DS1.1(A) R56.1
NetK_COM: K.COM T1.5 ; port TRANSFORM_VOUT+
NetQ4_1: Q4.1(G) R52.2 ; port INV_HS1
NetQ5_1: Q5.1(G) R53.2 ; port INV_HS2
NetQ6_1: Q6.1(G) R54.2 ; port INV_LS1
NetQ7_1: Q7.1(G) R55.2 ; port INV_LS2
NetQ8_2: Q8.2(B) R57.2 R58.2
NetR57_1: R57.1 ; port RELAY
NetT1_4: T1.4 ; port TRANSFORM_VOUT-

Not connected (* = marked no-connect by the designer): K A1* A2* NC* NO*; P10 1* 2*; R54 1; R55 1; T1 1* 2* 3* 6*

### Notes on the sheet
- Inverter
- (near K) 5V
- (near K) Power+
- Power+
- (near K) Relay_input
- GND
- Power-
- VOUT+
- (near T1) VOUT-
- Freisinberger Kristóf
- (in symbol CMP-35376-000008-1) +

### Library data of the parts
C31-C42 = CMP-35376-000008-1: as C19 on sheet BoostConverter
C43 = CAP: Capacitor; Value: 220nF
C44 = CAP_AC_68uF: Cap Film 68uF 100V PET 10% (31.5 X 22 X 36.5mm) Radial 27.5mm 125C Bulk; Manufacturer: TDK EPCOS; Manufacturer Part Number: B32524Q1686K000; Dielectric Material: Polyester; Lead Diameter: 0.8mm; Supplier 1: Digi-Key; RoHS: Yes; Category: Film Capacitors; Stock 1: 15; Pricing 1: 1=16,57000, 10=15,74200, 50=13,25680, 100=12,42830, 500=11,01972, 1000=10,35688 (USD); Case/Package: Radial; Min Operating Temperature: -55°C; Max Operating Temperature: 125°C; Capacitance: 68uF; Tolerance: 10%; Packaging: Bulk; Dielectric: PET; Voltage Rating (DC): 100V; Voltage Rating: 100V; Length: 31.5mm; Lead Pitch: 27.5mm; Depth: 22mm; REACH SVHC: No SVHC; RoHS Compliant: Yes; ComponentLink1URL: http://www.farnell.com/datasheets/1955213.pdf?src-supplier=Farnell; ComponentLink1Description: http://www.farnell.com/datasheets/1955213.pdf?src-supplier=Farnell; ComponentLink2URL: http://components.arrow.com/part/dataview/0323_01924821?src-supplier=Arrow+Europe; ComponentLink2Description: http://components.arrow.com/part/dataview/0323_01924821?src-supplier=Arrow+Europe; ComponentLink3URL: https://www.tdk-electronics.tdk.com/inf/20/20/db/fc_2009/B32520_529.pdf?src-supplier=Digi-Key; ComponentLink3Description: https://www.tdk-electronics.tdk.com/inf/20/20/db/fc_2009/B32520_529.pdf?src-supplier=Digi-Key; ComponentLink4URL: http://www.farnell.com/datasheets/1955213.pdf?src-supplier=Element14; ComponentLink4Description: http://www.farnell.com/datasheets/1955213.pdf?src-supplier=Element14
D2 = CMP-1055-00192-1: as D1 on sheet PowerSupply; Mounting Technology: Surface Mount; ComponentLink2Description: Datasheet; ComponentLink3URL: http://www.onsemi.cn/pub_link/Collateral/369C.PDF; DatasheetVersion: Rev. 8; ComponentLink2URL: http://www.onsemi.com/pub_link/Collateral/MBRD320-D.PDF; PackageDescription: 3-Pin Flange Mount, Body 6.54 x 6.095 mm, Pitch 2.29 mm; ComponentLink1URL: http://www.onsemi.com/; Packing: Tape and Reel; RoHS: TRUE; ComponentLink1Description: Manufacturer URL; ComponentLink3Description: Package Specification; PackageVersion: Rev. E, 02/2014; PackageReference: DPAK-3-369C-01; PartNumber: MBRD360T4G
DS1 = LED_G_CMP-1744-00002-1_1: Chip LED, Green, 2.2 V, -40 to 85 degC, 2-Pin SMD, RoHS, Tape and Reel; Frequency: 400 KHz; Max Supply Voltage: 5.5 V; Access Time: 3500 ns; Clock Frequency: 100 KHz; Case\Package: SOIC; Density: 32 kb; Nominal Supply Current: 2 mA; Interface: Serial; Min Supply Voltage: 1.7 V; Packaging: Tape and Reel; PackageReference: HSMX-C190; ComponentLink2URL: http://docs.avagotech.com/docs/AV02-0551EN; RoHSCompliant: true; Pins: 8; REACH SVHC: No SVHC; Max Operating Temperature: 85 degC; Width: 4 mm; Radiation Hardening: No; Package Quantity: 3000; ComponentLink3Description: Package Specification; ComponentLink1Description: Manufacturer URL; Min Operating Temperature: -40 degC; PackageDescription: 2-Pin Surface Mount Device, Body 1.6 x 0.8 mm, Height 0.9 mm; Max Clock Frequency: 100 KHz; Height: 1.5 mm; ComponentLink1URL: http://www.avagotech.com/; DatasheetVersion: Mar-12; ComponentLink2Description: Datasheet; Mount: Surface Mount; Length: 5 mm; ComponentLink3URL: http://www.fairchildsemi.com/dwg/MA/MA03D.pdf
J5-J8 = Terminal-CMP-2000-05797-1: as J_Accu_GND on sheet BoostConverter; Package Description: PC Terminal Block, Pitch 6.35 mm, 1 x 2 Position, Height 21.5 mm, Tail Lenght 5.1 mm; Datasheet URL: http://media.digikey.com/pdf/Data%20Sheets/Phoenix%20Contact%20PDFs/1714955.pdf; Package Reference: 1714955; Manufacturer URL: http://www.phoenixcontact.com/; Datasheet Version: 02/2010; Mounting Technology: ThroughHole
K = RELAY_SRD-05VDC-SL-C: 5V Trigger Relay Module For Arduino And Raspberry Pi 5V Trigger Relay Module For Arduino And Raspberry Pi; MF: Songle Relay; Package: None; Availability: Unavailable; Value: *; MP: SRD-05VDC-SL-C; SnapEDA_Link: https://www.snapeda.com/parts/SRD-05VDC-SL-C/Songle%20Relay/view-part/1029484/?ref=snap; Price: None
L3 = Tekercs: 14.9 uH inductor; Category: Inductor
P10 = Connector_2pin: 2pin connector
P13 = Connector_3pin: 3pin connector
Q4-Q7 = NMOS-2: as Q2 on sheet BoostConverter; Published: 8-Jun-2000; LatestRevisionDate: 17-Jul-2002; LatestRevisionNote: Re-released for DXP Platform.; DatasheetVersion: PD-9.814; PackageVersion: Feb-1997; PackageReference: TO-220AB; Publisher: Altium Limited; PackageDescription: TO, Thru-Hole, Vertical, Heatsink Mounted; 3 In-Line Leads; Pitch 2.54 mm; ComponentLink1Description: Manufacturer Link; ComponentLink1URL: http://www.irf.com/
Q8 = CMP-1048-01603-1: Amplifier Transistor, NPN Silicon, 3-Pin TO-92, Pb-Free, Tape and Reel; Manufacturer: On Semiconductor; fT Min (MHz): 150; IC Continuous (A): 0.1; ComponentLink3Description: Package Specification; ComponentLink1Description: Manufacturer URL; Packing: Tape and Reel; ComponentLink1URL: http://www.onsemi.com/; PackageReference: TO-92-3-29-11_AM_BL; Polarity: NPN; ComponentLink3URL: http://www.onsemi.com/pub_link/Collateral/MAC97-D.PDF; DatasheetVersion: Rev. 7; PackageDescription: 3-Pin Transistor Outline, Body 4.825 x 3.685 mm, Pitch 1.27 mm; ComponentLink2Description: Datasheet; PartNumber: BC548BRL1G; Mounting Technology: Through Hole; PackageVersion: Rev. AM; RoHS: TRUE; ComponentLink2URL: http://www.onsemi.com/pub_link/Collateral/BC546-D.PDF
R52-R58 = RES: Resistor
  R52-R55: Value: 3.3K
  R56-R58: Value: 1K
T1 = CMP-2000-05771-1: Pulse Transformer for LAN Interface, 2.5 dB, -40 to 85 degC, 6-Pin SMD, RoHS, Tape and Reel; Manufacturer: TDK; Insertion Loss: 2.5dB; Number of Output Ports: 1; Maximum Temperature: +85°C; Minimum Temperature: -40°C; Package Description: 6-Pin Surface Mount Device, Body 3.2 x 3.2 mm; Mounting Technology: SurfaceMount; Datasheet Version: 05/2016; Package Reference: ALT3232; Width: 3.2mm; Manufacturer URL: http://www.tdk.com/; Datasheet URL: https://product.tdk.com/info/en/catalog/datasheets/trans_alt_en.pdf; Length: 3.2mm; Mounting Type: SurfaceMount; Depth: 2.9mm; Dimensions: 3.2x3.2x2.9mm

## Sheet Gate-Driver.SchDoc
size A4
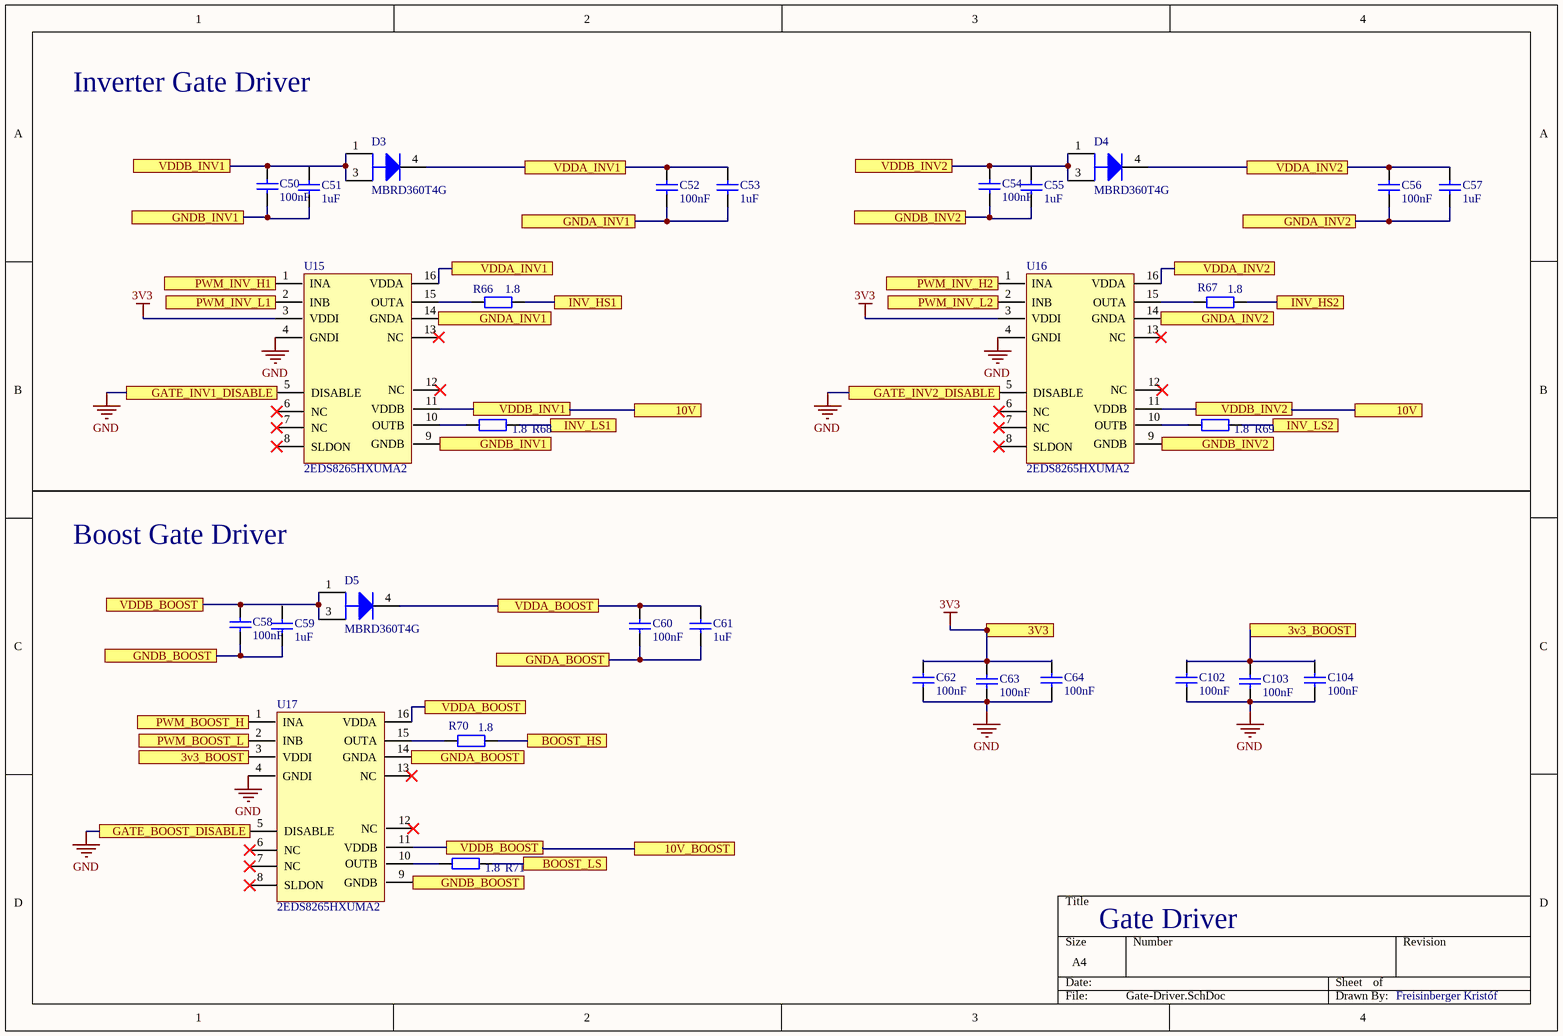
[diagram p4: Gate-Driver.SchDoc]

### Parts
C50  100nF  [FP_0805_CAP_085]
C51  1uF  [FP_0805_CAP_085]
C52  100nF  [FP_0805_CAP_085]
C53  1uF  [FP_0805_CAP_085]
C54  100nF  [FP_0805_CAP_085]
C55  1uF  [FP_0805_CAP_085]
C56  100nF  [FP_0805_CAP_085]
C57  1uF  [FP_0805_CAP_085]
C58  100nF  [FP_0805_CAP_085]
C59  1uF  [FP_0805_CAP_085]
C60  100nF  [FP_0805_CAP_085]
C61  1uF  [FP_0805_CAP_085]
C62  100nF  [FP_0805_CAP_085]
C63  100nF  [FP_0805_CAP_085]
C64  100nF  [FP_0805_CAP_085]
C102  100nF  [FP_0805_CAP_085]
C103  100nF  [FP_0805_CAP_085]
C104  100nF  [FP_0805_CAP_085]
D3  MBRD360T4G  [ONSC-DPAK-3-369C-01_V]
D4  MBRD360T4G  [ONSC-DPAK-3-369C-01_V]
D5  MBRD360T4G  [ONSC-DPAK-3-369C-01_V]
R66  1.8  [FP_0805_RES]
R67  1.8  [FP_0805_RES]
R68  1.8  [FP_0805_RES]
R69  1.8  [FP_0805_RES]
R70  1.8  [FP_0805_RES]
R71  1.8  [FP_0805_RES]
U15  2EDS8265HXUMA2  [EXAR-WSOIC-16_N]
U16  2EDS8265HXUMA2  [EXAR-WSOIC-16_N]
U17  2EDS8265HXUMA2  [EXAR-WSOIC-16_N]

### Ports
3V3, 3v3_BOOST, 10V, 10V_BOOST, BOOST_HS, BOOST_LS, GATE_BOOST_DISABLE, GATE_INV1_DISABLE, GATE_INV2_DISABLE, GNDA_BOOST, GNDA_INV1, GNDA_INV2, GNDB_BOOST, GNDB_INV1, GNDB_INV2, INV_HS1, INV_HS2, INV_LS1, INV_LS2, PWM_BOOST_H, PWM_BOOST_L, PWM_INV_H1, PWM_INV_H2, PWM_INV_L1, PWM_INV_L2, VDDA_BOOST, VDDA_INV1, VDDA_INV2, VDDB_BOOST, VDDB_INV1, VDDB_INV2

### Nets
3V3: C62.2 C63.2 C64.2 U15.3(VDDI) U16.3(VDDI) ; port 3V3
10V: C50.2 C54.2 D3.1(A) D3.3(A) D4.1(A) D4.3(A) U15.11(VDDB) U16.11(VDDB) ; port VDDB_INV1, port VDDB_INV2, port 10V
GND: C62.1 C63.1 C64.1 C102.1 C103.1 C104.1 U15.4(GNDI) U15.5(DISABLE) U16.4(GNDI) U16.5(DISABLE) U17.4(GNDI) U17.5(DISABLE) ; port GATE_BOOST_DISABLE, port GATE_INV1_DISABLE, port GATE_INV2_DISABLE  [project net Accumulator_GND]
NetC50_1: C50.1 C51.1 U15.9(GNDB) ; port GNDB_INV1
NetC52_1: C52.1 C53.1 U15.14(GNDA) ; port GNDA_INV1
NetC52_2: C52.2 C53.2 D3.4(K) U15.16(VDDA) ; port VDDA_INV1
NetC54_1: C54.1 C55.1 U16.9(GNDB) ; port GNDB_INV2
NetC56_1: C56.1 C57.1 U16.14(GNDA) ; port GNDA_INV2
NetC56_2: C56.2 C57.2 D4.4(K) U16.16(VDDA) ; port VDDA_INV2
NetC58_1: C58.1 C59.1 U17.9(GNDB) ; port GNDB_BOOST
NetC58_2: C58.2 D5.1(A) D5.3(A) U17.11(VDDB) ; port VDDB_BOOST, port 10V_BOOST
NetC60_1: C60.1 C61.1 U17.14(GNDA) ; port GNDA_BOOST
NetC60_2: C60.2 C61.2 D5.4(K) U17.16(VDDA) ; port VDDA_BOOST
NetC102_2: C102.2 C103.2 C104.2 U17.3(VDDI) ; port 3v3_BOOST
NetJ4_3: U17.1(INA) ; port PWM_BOOST_H
NetJ4_5: U17.2(INB) ; port PWM_BOOST_L
NetQ2_1: R70.2 ; port BOOST_HS
NetQ3_1: R71.2 ; port BOOST_LS
NetQ4_1: R66.2 ; port INV_HS1
NetQ5_1: R67.2 ; port INV_HS2
NetQ6_1: R68.2 ; port INV_LS1
NetQ7_1: R69.2 ; port INV_LS2
NetR3_2: U15.1(INA) ; port PWM_INV_H1
NetR4_2: U16.1(INA) ; port PWM_INV_H2
NetR5_2: U16.2(INB) ; port PWM_INV_L2
NetR6_2: U15.2(INB) ; port PWM_INV_L1
NetR66_1: R66.1 U15.15(OUTA)
NetR67_1: R67.1 U16.15(OUTA)
NetR68_1: R68.1 U15.10(OUTB)
NetR69_1: R69.1 U16.10(OUTB)
NetR70_1: R70.1 U17.15(OUTA)
NetR71_1: R71.1 U17.10(OUTB)

Not connected (* = marked no-connect by the designer): C51 2; C55 2; C59 2; U15 6(NC)* 7(NC)* 8(SLDON)* 12(NC)* 13(NC)*; U16 6(NC)* 7(NC)* 8(SLDON)* 12(NC)* 13(NC)*; U17 6(NC)* 7(NC)* 8(SLDON)* 12(NC)* 13(NC)*

### Notes on the sheet
- Inverter Gate Driver
- Boost Gate Driver
- Gate Driver
- Freisinberger Kristóf

### Library data of the parts
C50-C64 C102-C104 = CAP: Capacitor
  C50 C52 C54 C56 C58 C60 C62-C64 C102-C104: Value: 100nF
  C51 C53 C55 C57 C59 C61: Value: 1uF
D3-D5 = CMP-1055-00192-1: as D1 on sheet PowerSupply; Mounting Technology: Surface Mount; ComponentLink2Description: Datasheet; ComponentLink3URL: http://www.onsemi.cn/pub_link/Collateral/369C.PDF; DatasheetVersion: Rev. 8; ComponentLink2URL: http://www.onsemi.com/pub_link/Collateral/MBRD320-D.PDF; PackageDescription: 3-Pin Flange Mount, Body 6.54 x 6.095 mm, Pitch 2.29 mm; ComponentLink1URL: http://www.onsemi.com/; Packing: Tape and Reel; RoHS: TRUE; ComponentLink1Description: Manufacturer URL; ComponentLink3Description: Package Specification; PackageVersion: Rev. E, 02/2014; PackageReference: DPAK-3-369C-01; PartNumber: MBRD360T4G
R66-R71 = RES: Resistor; Value: 1.8
U15-U17 = GATE_DRIVER_2EDS8265HXUMA2: 2EDS8265HXUMA2 / Gate-Driver 8A; Manufacturer: Exar; Max Supply Voltage: 5.5V; Min Supply Voltage: 3V; Nominal Supply Current: 1mA; Number of Transmitters: 2; Logic Function: Transceiver; Number of Transceivers: 1; Propagation Delay: 0.15us; Number of I/Os: 4; Max Power Dissipation: 1.26W; Supplier 1: Allied Electronics; Manufacturer Part Number: 2EDS8265HXUMA2; RoHS: Yes; Category: RS-232 / RS-422 / RS-485 Interface ICs; Case/Package: SOIC W; Number of Pins: 16; Min Operating Temperature: 0°C; Max Operating Temperature: 70°C; Package Quantity: 41; Packaging: Rail/Tube; Series: -; Supply Current: 1mA; Number of Receivers: 2; Length: 10.3mm; Width: 7.5mm; Height: 2.55mm; Radiation Hardening: No; Lead Free: Lead Free; ComponentLink1URL: https://datasheet.ciiva.com/22828/0900766b81141d49-22828237.pdf?src-supplier=RSComponents; ComponentLink1Description: https://datasheet.ciiva.com/22828/0900766b81141d49-22828237.pdf?src-supplier=RSComponents; ComponentLink2URL: https://datasheet.ciiva.com/1715/sp3222eb-sp3232eb-103-081414-1715199.pdf?src-supplier=Digi-Key; ComponentLink2Description: https://datasheet.ciiva.com/1715/sp3222eb-sp3232eb-103-081414-1715199.pdf?src-supplier=Digi-Key; ComponentLink3URL: https://datasheet.ciiva.com/16380/sp3232ebca-l-16380121.pdf?src-supplier=Future+Electronics; ComponentLink3Description: https://datasheet.ciiva.com/16380/sp3232ebca-l-16380121.pdf?src-supplier=Future+Electronics; ComponentLink4URL: https://datasheet.ciiva.com/15208/getdatasheetpartid-558353-15208838.pdf?src-supplier=Verical; ComponentLink4Description: https://datasheet.ciiva.com/15208/getdatasheetpartid-558353-15208838.pdf?src-supplier=Verical; Number of Drivers: 2

## Sheet Block_Design.SchDoc
size A4
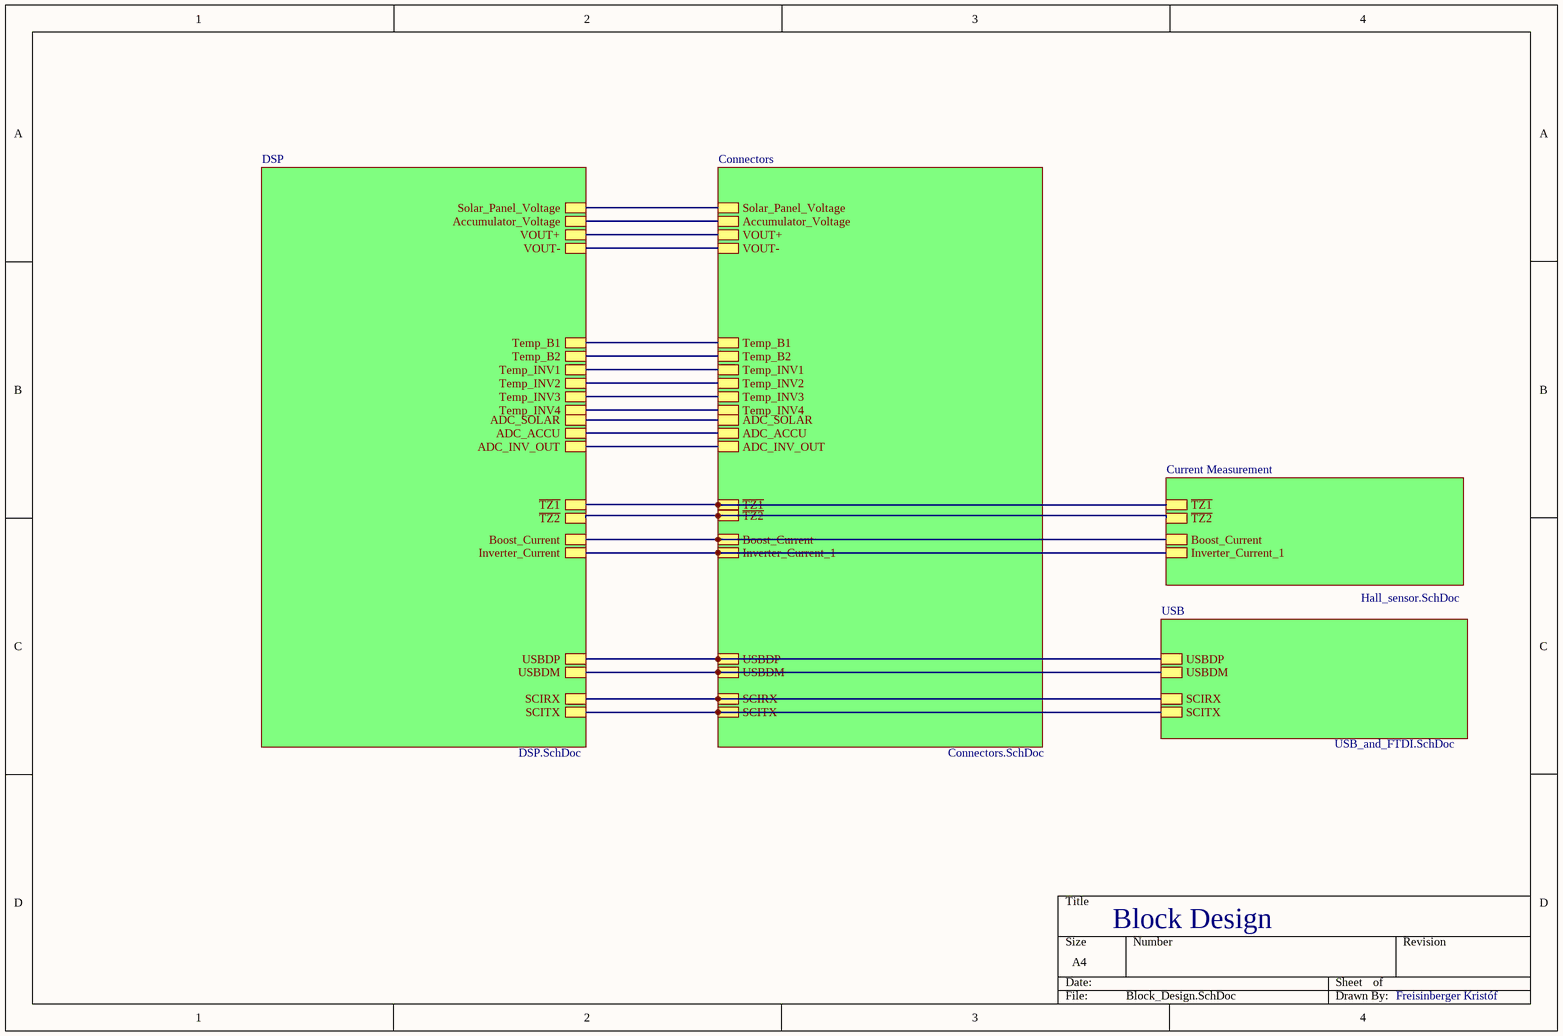
[diagram p5: Block_Design.SchDoc]

### Sub-sheets
Connectors = Connectors.SchDoc: Solar_Panel_Voltage, Accumulator_Voltage, VOUT+, VOUT-, Temp_B2, Temp_INV1, Temp_INV2, Temp_INV3, Temp_INV4, Temp_B1, ADC_SOLAR, ADC_ACCU, ADC_INV_OUT, USBDP, USBDM, SCIRX, SCITX, Boost_Current, Inverter_Current_1, ~{TZ1}, ~{TZ2}
Current Measurement = Hall_sensor.SchDoc: ~{TZ1}, ~{TZ2}, Inverter_Current_1, Boost_Current
DSP = DSP.SchDoc: Solar_Panel_Voltage, Accumulator_Voltage, VOUT+, VOUT-, Temp_B1, Temp_B2, Temp_INV1, Temp_INV2, Temp_INV3, Temp_INV4, ~{TZ1}, ~{TZ2}, ADC_SOLAR, ADC_ACCU, ADC_INV_OUT, SCITX, SCIRX, USBDM, USBDP, Boost_Current, Inverter_Current
USB = USB_and_FTDI.SchDoc: USBDP, USBDM, SCIRX, SCITX

### Nets
(unnamed): sheet DSP/Solar_Panel_Voltage, sheet Connectors/Solar_Panel_Voltage
(unnamed): sheet DSP/Accumulator_Voltage, sheet Connectors/Accumulator_Voltage
(unnamed): sheet DSP/VOUT+, sheet Connectors/VOUT+
(unnamed): sheet DSP/VOUT-, sheet Connectors/VOUT-
(unnamed): sheet DSP/Temp_B1, sheet Connectors/Temp_B1
(unnamed): sheet DSP/Temp_B2, sheet Connectors/Temp_B2
(unnamed): sheet DSP/Temp_INV1, sheet Connectors/Temp_INV1
(unnamed): sheet DSP/Temp_INV2, sheet Connectors/Temp_INV2
(unnamed): sheet DSP/Temp_INV3, sheet Connectors/Temp_INV3
(unnamed): sheet DSP/Temp_INV4, sheet Connectors/Temp_INV4
(unnamed): sheet DSP/~{TZ1}, sheet Connectors/~{TZ1}, sheet Current Measurement/~{TZ1}
(unnamed): sheet DSP/~{TZ2}, sheet Connectors/~{TZ2}, sheet Current Measurement/~{TZ2}
(unnamed): sheet DSP/ADC_SOLAR, sheet Connectors/ADC_SOLAR
(unnamed): sheet DSP/ADC_ACCU, sheet Connectors/ADC_ACCU
(unnamed): sheet DSP/ADC_INV_OUT, sheet Connectors/ADC_INV_OUT
(unnamed): sheet DSP/SCITX, sheet Connectors/SCITX, sheet USB/SCITX
(unnamed): sheet DSP/SCIRX, sheet Connectors/SCIRX, sheet USB/SCIRX
(unnamed): sheet DSP/USBDM, sheet Connectors/USBDM, sheet USB/USBDM
(unnamed): sheet DSP/USBDP, sheet Connectors/USBDP, sheet USB/USBDP
(unnamed): sheet DSP/Boost_Current, sheet Connectors/Boost_Current, sheet Current Measurement/Boost_Current
(unnamed): sheet DSP/Inverter_Current, sheet Connectors/Inverter_Current_1, sheet Current Measurement/Inverter_Current_1

### Notes on the sheet
- Block Design
- Freisinberger Kristóf

## Sheet DSP.SchDoc
size A4
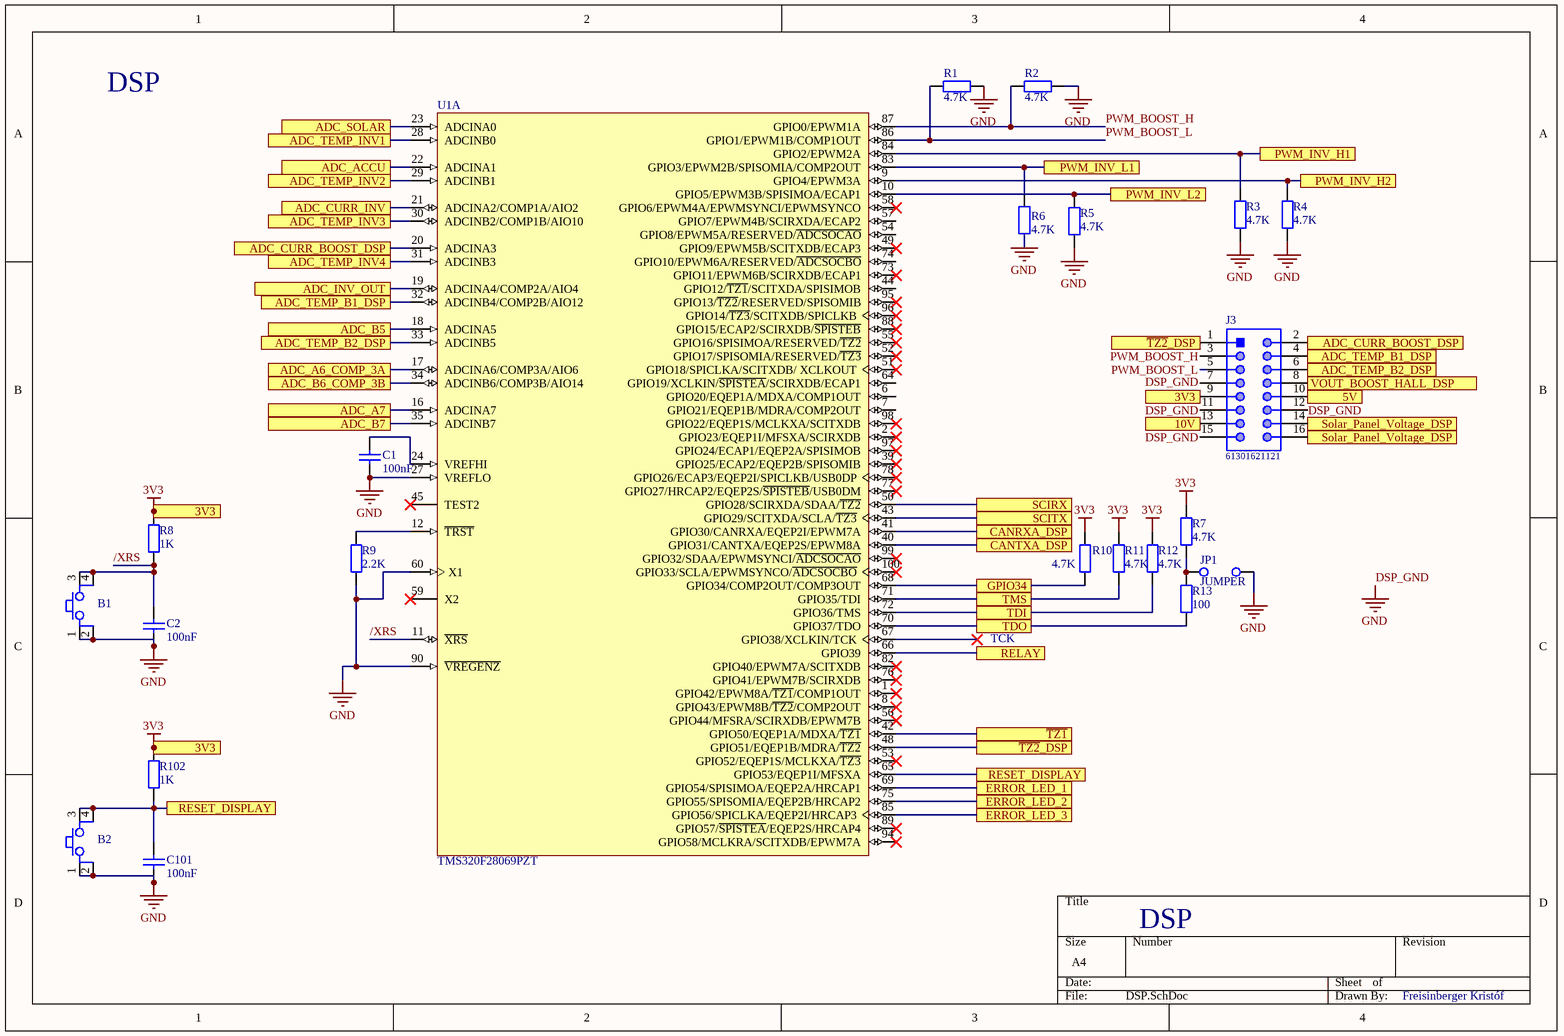
[diagram p6: DSP.SchDoc]

### Parts
B1  Button  [FP_BTN_SMD]  (value not drawn)
B2  Button  [FP_BTN_SMD]  (value not drawn)
C1  100nF  [FP_0805_CAP_085]
C2  100nF  [FP_0805_CAP_085]
C101  100nF  [FP_0805_CAP_085]
J3  61301621121  [61301621121]
JP1  JUMPER  [FP_CONN2_TUSKE_254MM]
R1  4.7K  [FP_0805_RES]
R2  4.7K  [FP_0805_RES]
R3  4.7K  [FP_0805_RES]
R4  4.7K  [FP_0805_RES]
R5  4.7K  [FP_0805_RES]
R6  4.7K  [FP_0805_RES]
R7  4.7K  [FP_0805_RES]
R8  1K  [FP_0805_RES]
R9  2.2K  [FP_0805_RES]
R10  4.7K  [FP_0805_RES]
R11  4.7K  [FP_0805_RES]
R12  4.7K  [FP_0805_RES]
R13  100  [FP_0805_RES]
R102  1K  [FP_0805_RES]
U1  TMS320F28069PZT  [PZ0100A_N]  (part A of 2)

### Ports
3V3, 5V, 10V, ADC_A6_COMP_3A, ADC_A7, ADC_ACCU, ADC_B5, ADC_B6_COMP_3B, ADC_B7, ADC_CURR_BOOST_DSP, ADC_CURR_INV, ADC_INV_OUT, ADC_SOLAR, ADC_TEMP_B1_DSP, ADC_TEMP_B2_DSP, ADC_TEMP_INV1, ADC_TEMP_INV2, ADC_TEMP_INV3, ADC_TEMP_INV4, CANRXA_DSP, CANTXA_DSP, ERROR_LED_1, ERROR_LED_2, ERROR_LED_3, GPIO34, PWM_INV_H1, PWM_INV_H2, PWM_INV_L1, PWM_INV_L2, RELAY, RESET_DISPLAY, SCIRX, SCITX, Solar_Panel_Voltage_DSP, TDI, TDO, TMS, VOUT_BOOST_HALL_DSP, ~{TZ1}, ~{TZ2}_DSP

### Nets
3V3: J3.9 R7.2 R8.2 R10.2 R11.2 R12.2 R102.2 ; port 3V3
5V: J3.10 ; port 5V
10V: J3.13 ; port 10V
DSP_GND: B1.1 B1.2 B2.1 B2.2 C1.1 C2.1 C101.1 J3.11 J3.12 J3.15 JP1.2(C2) R1.2 R2.1 R3.1 R4.1 R5.1 R6.1 R9.1 U1.27(VREFLO) U1.60(X1) U1.90(~{VREGENZ})  [also labelled GND]  [project net Accumulator_GND]
/XRS: B1.3 B1.4 C2.2 R8.1 U1.11(~{XRS})
PWM_BOOST_H: J3.3 R2.2 U1.87(GPIO0/EPWM1A)
PWM_BOOST_L: J3.5 R1.1 U1.86(GPIO1/EPWM1B/COMP1OUT)
NetB2_3: B2.3 B2.4 C101.2 R102.1 U1.65(GPIO53/EQEP1I/MFSXA) ; port RESET_DISPLAY
NetC1_2: C1.2 U1.24(VREFHI)
NetC11_2: U1.23(ADCINA0) ; port ADC_SOLAR
NetC12_2: U1.22(ADCINA1) ; port ADC_ACCU
NetC14_1: J3.14 J3.16 ; port Solar_Panel_Voltage_DSP
NetC65_1: U1.21(ADCINA2/COMP1A/AIO2) ; port ADC_CURR_INV
NetC73_2: U1.41(GPIO30/CANRXA/EQEP2I/EPWM7A) ; port CANRXA_DSP
NetJ3_1: J3.1 U1.48(GPIO51/EQEP1B/MDRA/~{TZ2}) ; port ~{TZ2}_DSP
NetJ3_2: J3.2 U1.20(ADCINA3) ; port ADC_CURR_BOOST_DSP
NetJ3_4: J3.4 U1.32(ADCINB4/COMP2B/AIO12) ; port ADC_TEMP_B1_DSP
NetJ3_6: J3.6 U1.33(ADCINB5) ; port ADC_TEMP_B2_DSP
NetJ3_8: J3.8 ; port VOUT_BOOST_HALL_DSP
NetJP1_1: JP1.1(C1) R7.1 R13.2
NetP2_3: U1.19(ADCINA4/COMP2A/AIO4) ; port ADC_INV_OUT
NetP3_3: U1.28(ADCINB0) ; port ADC_TEMP_INV1
NetP3_4: U1.29(ADCINB1) ; port ADC_TEMP_INV2
NetP3_5: U1.30(ADCINB2/COMP1B/AIO10) ; port ADC_TEMP_INV3
NetP3_6: U1.31(ADCINB3) ; port ADC_TEMP_INV4
NetP4_3: U1.50(GPIO28/SCIRXDA/SDAA/~{TZ2}) ; port SCIRX
NetP4_4: U1.43(GPIO29/SCITXDA/SCLA/~{TZ3}) ; port SCITX
NetP5_2: U1.18(ADCINA5) ; port ADC_B5
NetP5_3: U1.17(ADCINA6/COMP3A/AIO6) ; port ADC_A6_COMP_3A
NetP5_4: U1.34(ADCINB6/COMP3B/AIO14) ; port ADC_B6_COMP_3B
NetP5_5: U1.16(ADCINA7) ; port ADC_A7
NetP5_6: U1.35(ADCINB7) ; port ADC_B7
NetR3_2: R3.2 U1.84(GPIO2/EPWM2A) ; port PWM_INV_H1
NetR4_2: R4.2 U1.9(GPIO4/EPWM3A) ; port PWM_INV_H2
NetR5_2: R5.2 U1.10(GPIO5/EPWM3B/SPISIMOA/ECAP1) ; port PWM_INV_L2
NetR6_2: R6.2 U1.83(GPIO3/EPWM2B/SPISOMIA/COMP2OUT) ; port PWM_INV_L1
NetR9_2: R9.2 U1.12(~{TRST})
NetR10_1: R10.1 U1.68(GPIO34/COMP2OUT/COMP3OUT) ; port GPIO34
NetR11_1: R11.1 U1.71(GPIO35/TDI) ; port TMS
NetR12_1: R12.1 U1.72(GPIO36/TMS) ; port TDI
NetR13_1: R13.1 U1.70(GPIO37/TDO) ; port TDO
NetR57_1: U1.66(GPIO39) ; port RELAY
NetR72_1: U1.42(GPIO50/EQEP1A/MDXA/~{TZ1}) ; port ~{TZ1}
NetR90_1: U1.69(GPIO54/SPISIMOA/EQEP2A/HRCAP1) ; port ERROR_LED_1
NetR98_1: U1.85(GPIO56/SPICLKA/EQEP2I/HRCAP3) ; port ERROR_LED_3
NetR99_1: U1.75(GPIO55/SPISOMIA/EQEP2B/HRCAP2) ; port ERROR_LED_2
NetU1_40: U1.40(GPIO31/CANTXA/EQEP2S/EPWM8A) ; port CANTXA_DSP

Not connected (* = marked no-connect by the designer): J3 7; U1 1(GPIO42/EPWM8A/~{TZ1}/COMP1OUT)* 2(GPIO23/EQEP1I/MFSXA/SCIRXDB)* 6(GPIO20/EQEP1A/MDXA/COMP1OUT) 7(GPIO21/EQEP1B/MDRA/COMP2OUT) 8(GPIO43/EPWM8B/~{TZ2}/COMP2OUT)* 39(GPIO25/ECAP2/EQEP2B/SPISOMIB)* 44(GPIO12/~{TZ1}/SCITXDA/SPISIMOB) 45(TEST2)* 49(GPIO9/EPWM5B/SCITXDB/ECAP3)* 51(GPIO18/SPICLKA/SCITXDB/_XCLKOUT)* 52(GPIO17/SPISOMIA/RESERVED/~{TZ3})* 53(GPIO52/EQEP1S/MCLKXA/~{TZ3})* 54(GPIO8/EPWM5A/RESERVED/~{ADCSOCAO}) 55(GPIO16/SPISIMOA/RESERVED/~{TZ2})* 56(GPIO44/MFSRA/SCIRXDB/EPWM7B)* 57(GPIO7/EPWM4B/SCIRXDA/ECAP2) 58(GPIO6/EPWM4A/EPWMSYNCI/EPWMSYNCO)* 59(X2)* 64(GPIO19/XCLKIN/~{SPISTEA}/SCIRXDB/ECAP1) 67(GPIO38/XCLKIN/TCK)* 73(GPIO11/EPWM6B/SCIRXDB/ECAP1)* 74(GPIO10/EPWM6A/RESERVED/~{ADCSOCBO}) 76(GPIO41/EPWM7B/SCIRXDB)* 77(GPIO27/HRCAP2/EQEP2S/~{SPISTEB}/USB0DM)* 78(GPIO26/ECAP3/EQEP2I/SPICLKB/USB0DP)* 82(GPIO40/EPWM7A/SCITXDB)* 88(GPIO15/ECAP2/SCIRXDB/~{SPISTEB})* 89(GPIO57/~{SPISTEA}/EQEP2S/HRCAP4)* 94(GPIO58/MCLKRA/SCITXDB/EPWM7A)* 95(GPIO13/~{TZ2}/RESERVED/SPISOMIB)* 96(GPIO14/~{TZ3}/SCITXDB/SPICLKB)* 97(GPIO24/ECAP1/EQEP2A/SPISIMOB)* 98(GPIO22/EQEP1S/MCLKXA/SCITXDB)* 99(GPIO32/SDAA/EPWMSYNCI/~{ADCSOCAO})* 100(GPIO33/SCLA/EPWMSYNCO/~{ADCSOCBO})*

### Notes on the sheet
- DSP
- TCK
- Freisinberger Kristóf
- Labels drawn without touching a wire or pin: DSP_GND

### Library data of the parts
B1 B2 = Button 4P: Push button
C1 C2 C101 = CAP: Capacitor; Value: 100nF
J3 = CMP-1502-01097-1: as J4 on sheet BoostConverter; Mounting Technology: THT; Orientation: Vertical; Manufacturer URL: http://www.we-online.de; Row Number: Dual; Part Number: 61301621121; Datasheet URL: https://katalog.we-online.de/em/datasheet/6130xx21121.pdf; Packaging: Bag; Operating Temperature: -40to105degC; Publisher: WurthElektronik; Package Reference: 61301621121
JP1 = JUMPER: Jumper Wire
R1-R13 R102 = RES: Resistor
  R1-R7 R10-R12: Value: 4.7K
  R8 R102: Value: 1K
  R9: Value: 2.2K
  R13: Value: 100
U1 = DSP_100_CMP-0546-00052-3: Piccolo Microcontroller, High-Efficiency 32-Bit CPU, 100 KB, 90 MHz, FPU, VCU, 19 Ch PWM, 54 GPIO, 3.3 V, -40 to 105 degC, 100-Pin LQFP (PZ), Green (RoHS & no Sb/Br); Manufacturer: Texas Instruments; CAP/QEP: 7/2; Peak MMACS: 90; IO Supply (V): 3.3; 12-bit A/D (#Channels): 16; PWM (Ch): 19; CLA: 1; Timers: 3 32-Bit GP 1 WD; VCU: Yes; RAM (KB): 100; CPU: C28x; GPIO: 54; USB: 0; PackageVersion: 4040149/B; Operating Temperature Range (degC): -40 to 105; Mounting Technology: Surface Mount; ComponentLink2URL: http://www.ti.com/lit/ds/symlink/tms320f28069.pdf; DatasheetVersion: SPRS698D; PartNumber: TMS320F28069PZT; FPU: Yes; Frequency (MHz): 90; ComponentLink3Description: Package Specification; ComponentLink3URL: http://www.ti.com/lit/ds/symlink/tms320f28066.pdf; PackageDescription: 100-Pin Plastic Quad Flat Package, Body 14 x 14 mm, Pitch 0.5 mm; PackageReference: PZ0100A; ComponentLink1URL: http://www.ti.com/; ComponentLink2Description: Datasheet; ComponentLink1Description: Manufacturer URL; Eco Plan: Green (RoHS & no Sb/Br)